# EAGLE design SKAARDUINO_v4 (EAGLE 7.5.0)

## Sheet 1 of 3
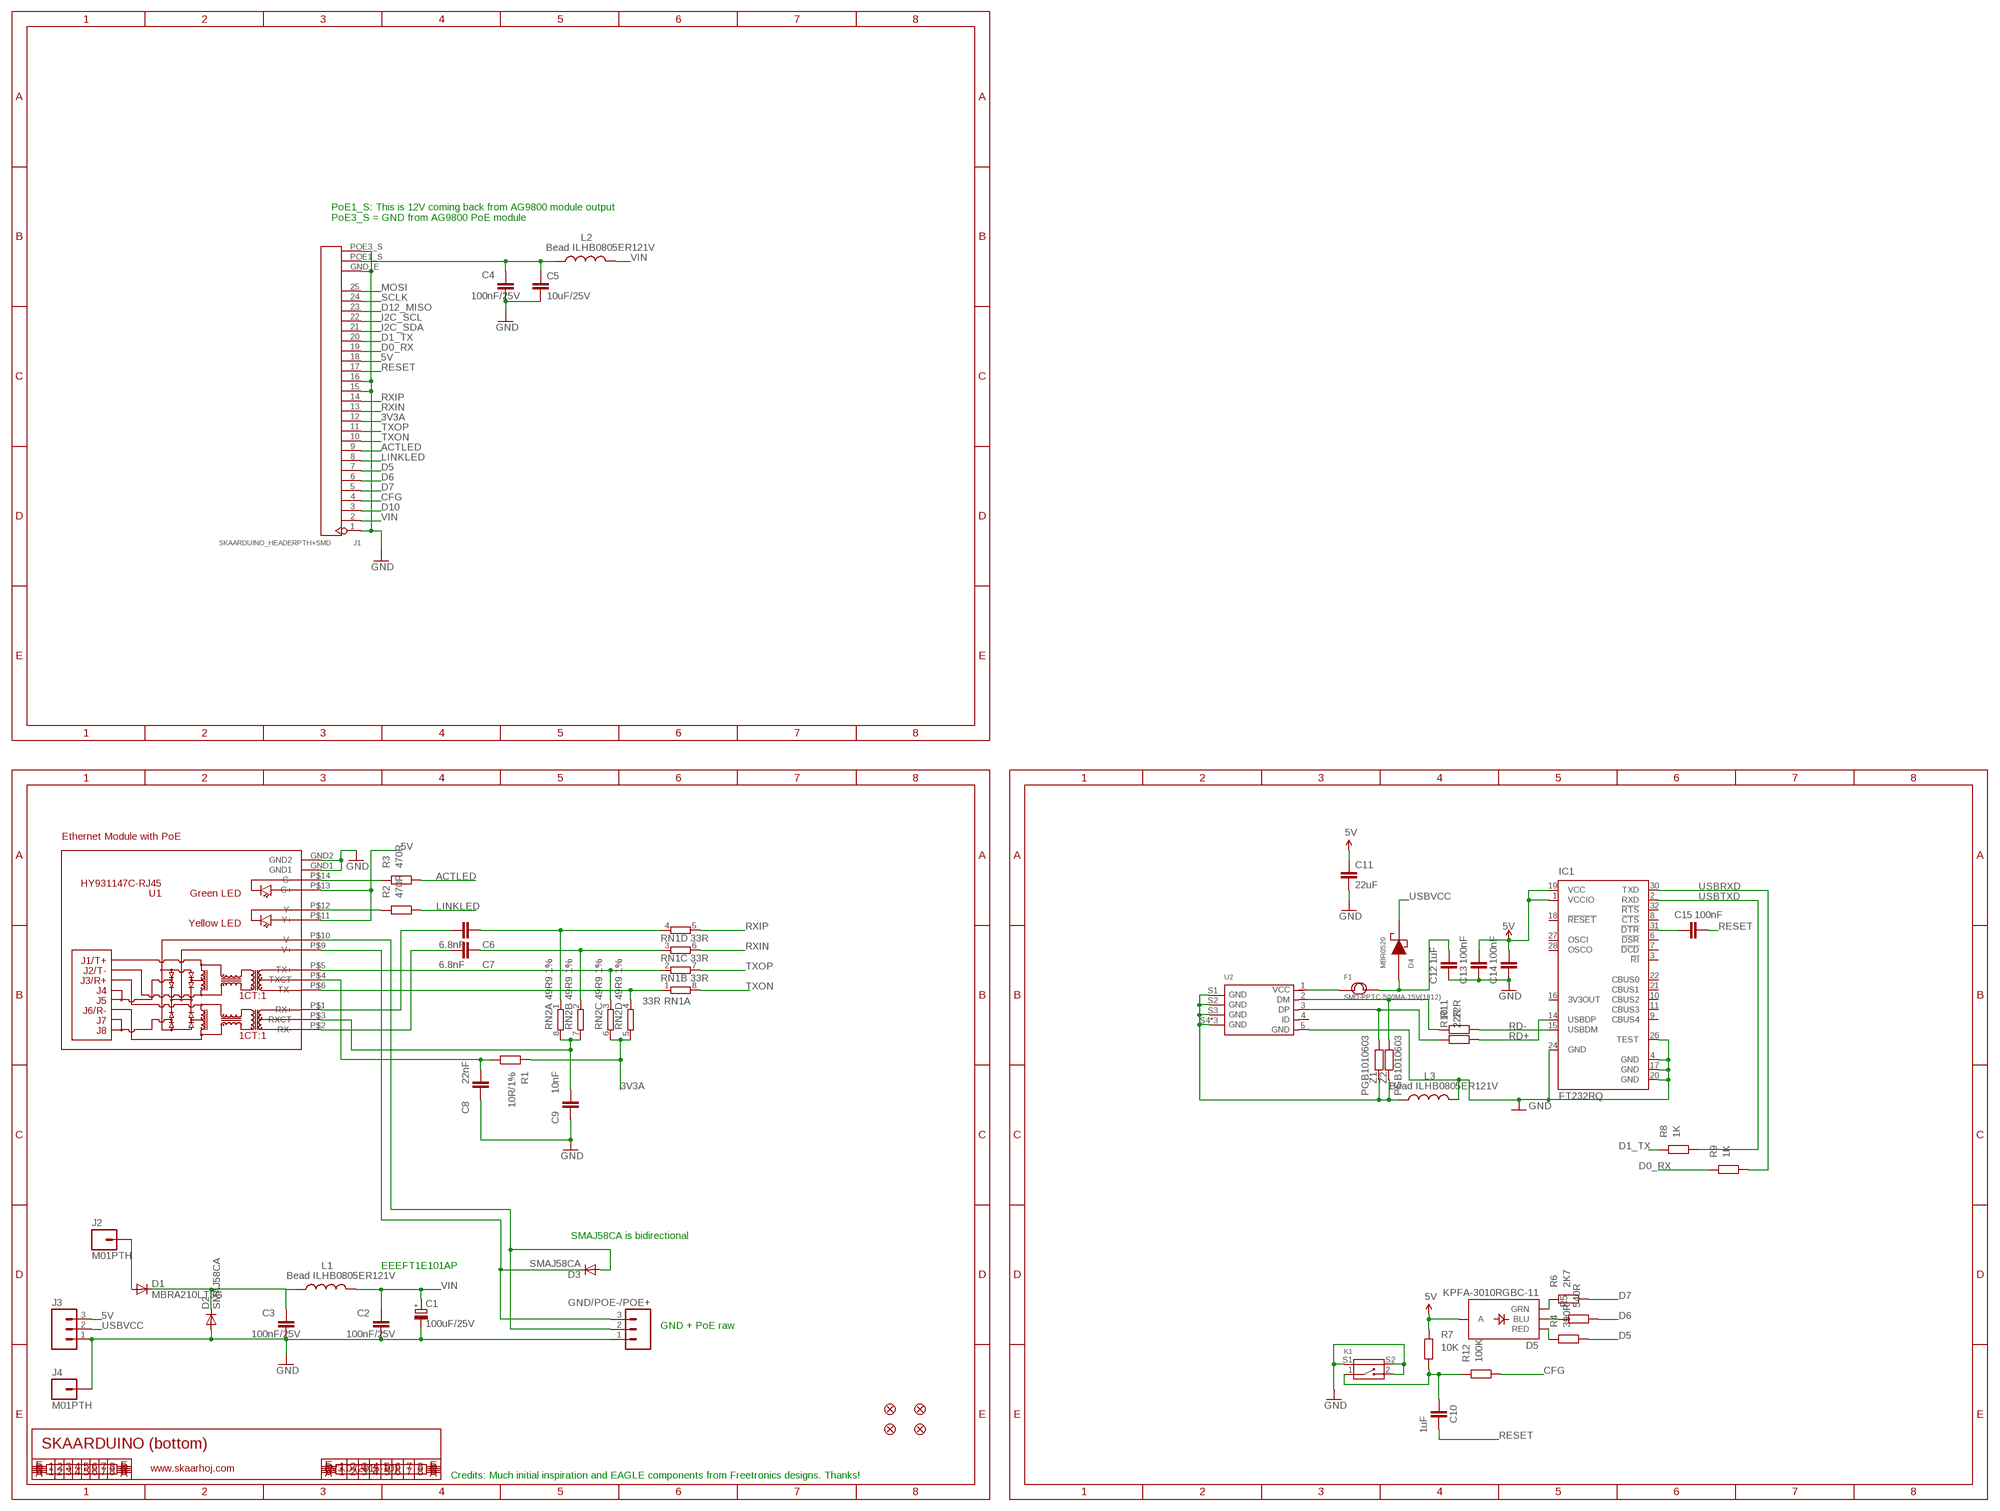
[diagram p0: schematic, sheet 1]

### Parts
C1  100uF/25V  CPOL-EUD  [PANASONIC_D]
C2  100nF/25V  CAP0402  [C0402]
C3  100nF/25V  CAP0402  [C0402]
C4  100nF/25V  CAP0402  [C0402]
C5  10uF/25V  CAP0805  [0805]
C6  6.8nF  C-EU0402C  [0402C]
C7  6.8nF  C-EU0402C  [0402C]
C8  22nF  C-EU0402C  [0402C]
C9  10nF  C-EU0402C  [0402C]
C10  1uF  C-EU0402C  [0402C]
C11  22uF  CAP0805  [0805]
C12  1uF  C-EU0402C  [0402C]
C13  100nF  C-EU0402C  [0402C]
C14  100nF  C-EU0402C  [0402C]
C15  100nF  C-EU0402C  [0402C]
D1  MBRA210LT3G  DIODESMA  [SMA-DIODE]
D2  SMAJ58CA  DIODESMA  [SMA-DIODE]
D3  SMAJ58CA  DIODESMA  [SMA-DIODE]
D4  MBR0520  [SOD-123]
D5  KPFA-3010RGBC-11  LED-TRICOLOR  [LED-TRICOLOR-SMD]
F1  SMD-PPTC-500MA-15V(1812)  [F1812]
FID1  FIDUCIAL1X2.5  [FIDUCIAL-1X2.5]
FID2  FIDUCIAL1X2.5  [FIDUCIAL-1X2.5]
FID3  FIDUCIAL1X2.5  [FIDUCIAL-1X2.5]
FID4  FIDUCIAL1X2.5  [FIDUCIAL-1X2.5]
GND/POE-/POE+  M03LOCK  [1X03_LOCK]
IC1  FT232RQ  [QFN32]
J1  SKAARDUINO_HEADERPTH+SMD  [SKAARDUINO_PTH_SMD_HEADER]
J2  M01PTH  [1X01]
J3  M03LOCK  [1X03_LOCK]
J4  M01PTH  [1X01]
K1  SMD-BUTTON-2+2P  [SW4-SMD-7.0X3.5X3.5MM-90D]
L1  Bead ILHB0805ER121V  L-USL2012C  [L2012C]
L2  Bead ILHB0805ER121V  L-USL2012C  [L2012C]
L3  Bead ILHB0805ER121V  L-USL2012C  [L2012C]
R1  10R/1%  RESISTOR0402  [0402]
R2  470R  RESISTOR0402  [0402]
R3  470R  RESISTOR0402  [0402]
R4  390R  RESISTOR0402  [0402]
R5  540R  RESISTOR0402  [0402]
R6  2K7  RESISTOR0402  [0402]
R7  10K  RESISTOR0402  [0402]
R8  1K  RESISTOR0402  [0402]
R9  1K  RESISTOR0402  [0402]
R10  22R  RESISTOR0402  [0402]
R11  22R  RESISTOR0402  [0402]
R12  100K  RESISTOR0402  [0402]
RN1  33R  4R-NCAY16  [CAY16]
RN2  49R9 1%  4R-NCAY16  [CAY16]
U1  HY931147C-RJ45  [HY931147C]
U2  MICRO-USB-SMD-B-WITHOUT-POST-W/P(ST-USB-001G)  [MICRO-USB5+4P-SMD-0.65-B]
Z1  PGB1010603  RESISTOR0402  [C0402]
Z2  PGB1010603  RESISTOR0402  [C0402]

### Nets
3V3A: J1.12 R1.2 RN2.5 RN2.6 ; also sheet 2
5V [power]: C11.1 C13.2 C14.2 D5.A IC1.1(VCCIO) IC1.19(VCC) J1.18 J3.3 R7.2 U1.P$11(Y+) U1.P$13(G+) ; also sheet 2
ACTLED: J1.9 R3.1 ; also sheet 2
CFG: J1.4 R12.1 ; also sheet 2
CFGSW: C10.2 K1.1 R7.1 R12.2
D0_RX: J1.19 R9.2 ; also sheet 2
D1_TX: J1.20 R8.2 ; also sheet 2
D5: J1.7 R4.1 ; also sheet 2
D6: J1.6 R5.1 ; also sheet 2
D7: J1.5 R6.1 ; also sheet 2
D10: J1.3 ; also sheet 2
D12_MISO: J1.23 ; also sheet 2
GND [power]: C1.- C2.2 C3.2 C4.2 C5.2 C8.1 C9.1 C11.2 C12.1 C13.1 C14.1 D2.A GND/POE-/POE+.1 IC1.4(GND) IC1.17(GND) IC1.20(GND) IC1.24(GND) IC1.26(TEST) J1.1 J1.15 J1.16 J1.GND_E J1.POE3_S J3.1 J4.1 K1.2 K1.S1 K1.S2 L3.2 U1.GND1 U1.GND2 U2.5(GND) ; also sheet 2
I2C_SCL: J1.22 ; also sheet 2
I2C_SDA: J1.21 ; also sheet 2
LINKLED: J1.8 R2.1 ; also sheet 2
MOSI: J1.25 ; also sheet 2
N$1: C8.2 R1.1 U1.P$4(TXCT)
N$2 [VIN]: C4.1 C5.1 J1.POE1_S L2.1
N$3 [VIN]: D3.C GND/POE-/POE+.3 U1.P$9(V+)
N$4 [VIN]: C3.1 D1.C D2.C L1.1
N$5 [VIN]: D3.A GND/POE-/POE+.2 U1.P$10(V-)
N$6 [VIN]: C12.2 D4.2(AN) F1.2
N$7 [VIN]: F1.1 U2.1(VCC)
N$9: C7.2 U1.P$2(RX-)
N$10: D5.G(GRN) R6.2
N$11: C6.2 U1.P$1(RX+)
N$13 [VIN]: D1.A J2.1
N$14: D5.B(BLU) R5.2
N$15: D5.R(RED) R4.2
N$16: R10.2 U2.3(DP) Z1.1
N$17: R11.2 U2.2(DM) Z2.1
N$18: C15.1 IC1.31(!DTR)
N$21: L3.1 U2.S1(GND) U2.S2(GND) U2.S3(GND) U2.S4(GND) U2.S5(GND) U2.S6(GND) Z1.2 Z2.2
N$67: R3.2 U1.P$14(G-)
N$321: C9.2 RN2.7 RN2.8 U1.P$3(RXCT)
N$332: R2.2 U1.P$12(Y-)
RD+: IC1.14(USBDP) R10.1
RD-: IC1.15(USBDM) R11.1
RESET: C10.1 C15.2 J1.17 ; also sheet 2
RXIN: J1.13 RN1.6 ; also sheet 2
RXIN_E: C7.1 RN1.3 RN2.2
RXIP: J1.14 RN1.5 ; also sheet 2
RXIP_E: C6.1 RN1.4 RN2.1
SCLK: J1.24 ; also sheet 2
TXON: J1.10 RN1.8 ; also sheet 2
TXON_E: RN1.1 RN2.4 U1.P$6(TX-)
TXOP: J1.11 RN1.7 ; also sheet 2
TXOP_E: RN1.2 RN2.3 U1.P$5(TX+)
USBRXD: IC1.30(TXD) R9.1
USBTXD: IC1.2(RXD) R8.1
USBVCC [VIN]: D4.1(CA) J3.2
VIN [VIN]: C1.+ C2.1 J1.2 L1.2 L2.2 ; also sheet 2
Unconnected: IC1.3(!RI) IC1.6(!DSR) IC1.7(!DCD) IC1.8(!CTS) IC1.9(CBUS4) IC1.10(CBUS2) IC1.11(CBUS3) IC1.16(3V3OUT) IC1.18(!RESET) IC1.21(CBUS1) IC1.22(CBUS0) IC1.27(OSCI) IC1.28(OSCO) IC1.32(!RTS) U2.4(ID)

### Notes on the sheet
- PoE1_S: This is 12V coming back from AG9800 module output
  PoE3_S = GND from AG9800 PoE module
- Ethernet Module with PoE
- SMAJ58CA is bidirectional
- EEEFT1E101AP
- GND + PoE raw
- SKAARDUINO (bottom)
- www.skaarhoj.com | V3.0 (2015-10)
- Credits: Much initial inspiration and EAGLE components from Freetronics designs. Thanks!

## Sheet 2 of 3
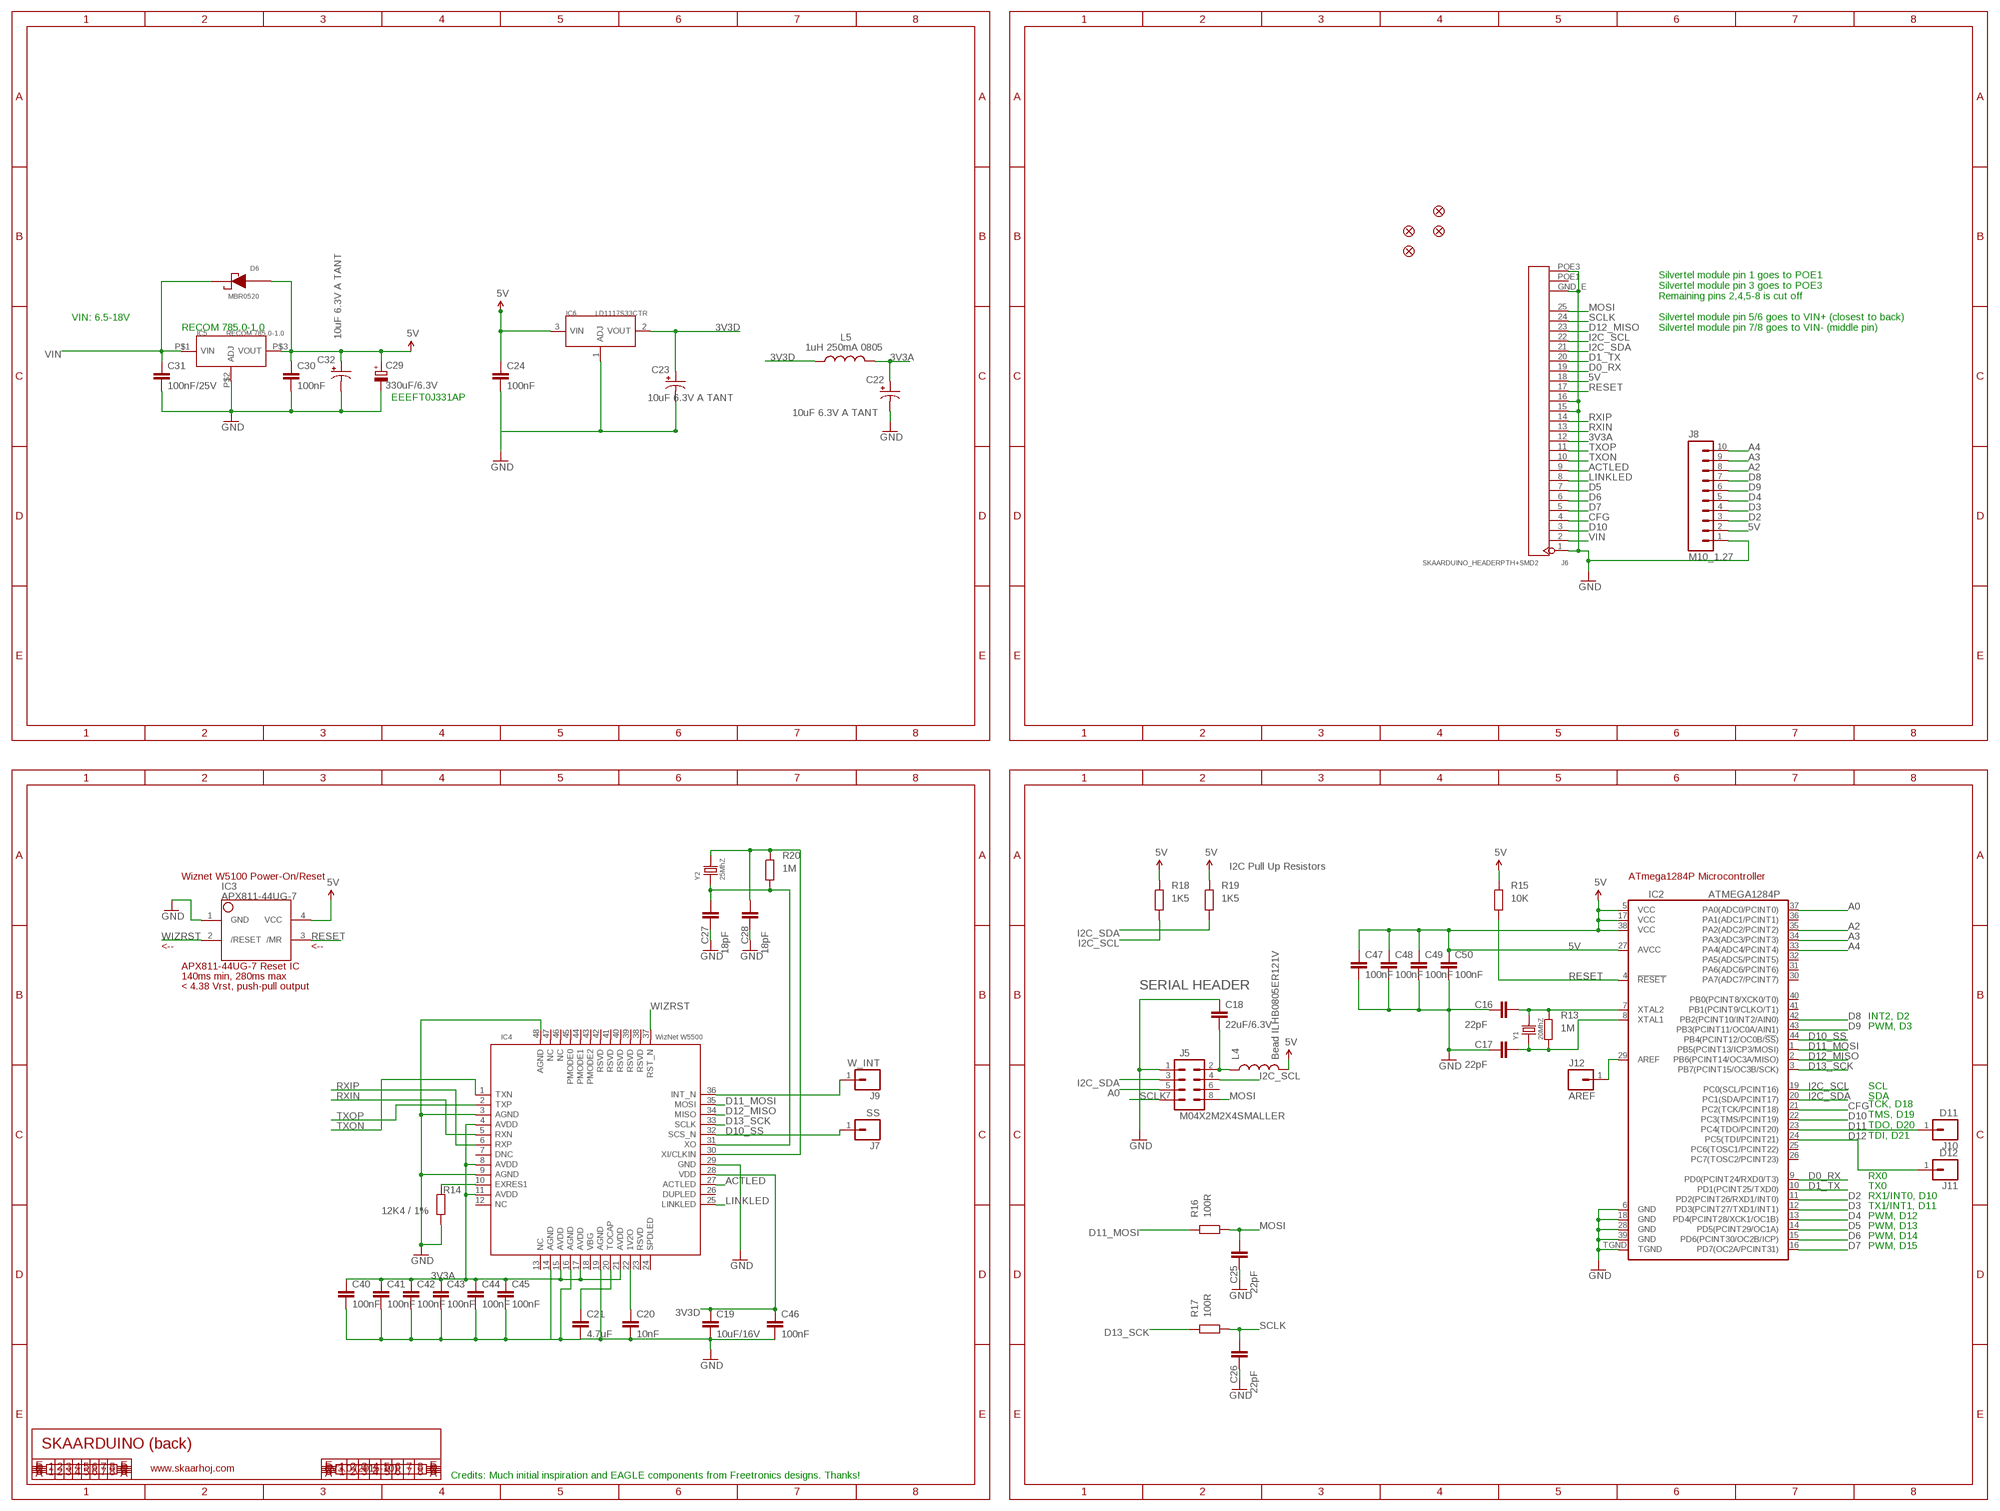
[diagram p1: schematic, sheet 2]

### Parts
C16  22pF  C-EU0402C  [0402C]
C17  22pF  C-EU0402C  [0402C]
C18  22uF/6.3V  CAP0805  [0805]
C19  10uF/16V  CAP0805  [0805]
C20  10nF  C-EU0402C  [0402C]
C21  4.7uF  CAP0805  [0805]
C22  10uF 6.3V A TANT  CAP_POL1206  [EIA3216]
C23  10uF 6.3V A TANT  CAP_POL1206  [EIA3216]
C24  100nF  C-EU0402C  [0402C]
C25  22pF  C-EU0402C  [0402C]
C26  22pF  C-EU0402C  [0402C]
C27  18pF  C-EU0402C  [0402C]
C28  18pF  C-EU0402C  [0402C]
C29  330uF/6.3V  CPOL-EUD  [PANASONIC_D]
C30  100nF  C-EU0402C  [0402C]
C31  100nF/25V  C-EU0402C  [0402C]
C32  10uF 6.3V A TANT  CAP_POL1206  [EIA3216]
C40  100nF  C-EU0402C  [0402C]
C41  100nF  C-EU0402C  [0402C]
C42  100nF  C-EU0402C  [0402C]
C43  100nF  C-EU0402C  [0402C]
C44  100nF  C-EU0402C  [0402C]
C45  100nF  C-EU0402C  [0402C]
C46  100nF  C-EU0402C  [0402C]
C47  100nF  C-EU0402C  [0402C]
C48  100nF  C-EU0402C  [0402C]
C49  100nF  C-EU0402C  [0402C]
C50  100nF  C-EU0402C  [0402C]
D6  MBR0520  [SOD-123]
FID5  FIDUCIAL1X2.5  [FIDUCIAL-1X2.5]
FID6  FIDUCIAL1X2.5  [FIDUCIAL-1X2.5]
FID7  FIDUCIAL1X2.5  [FIDUCIAL-1X2.5]
FID8  FIDUCIAL1X2.5  [FIDUCIAL-1X2.5]
IC2  ATMEGA1284P  [QFN-44M1]
IC3  APX811-44UG-7  APX81X-RESET-IC  [SOT143-R]
IC4  WizNet W5500  DRIVER-W5500  [LQFP-48]
IC5  RECOM 785.0-1.0  PMIC-LM317EMP  [RECOM_785.0-1.0]
IC6  LD1117S33CTR  PMIC-LM317EMPUPRIGHT  [SOT-223-UPRIGHT]
J5  M04X2M2X4SMALLER  [M2X4SMALLER]
J6  SKAARDUINO_HEADERPTH+SMD2  [SKAARDUINO_PTH_SMD2_HEADER]
J7  SS  M1X1TEST  [M1X1]
J8  M10_1.27  [M10X1]
J9  W_INT  M1X1TEST  [M1X1]
J10  D11  M1X1TEST  [M1X1]
J11  D12  M1X1TEST  [M1X1]
J12  AREF  M1X1TEST  [M1X1]
L4  Bead ILHB0805ER121V  INDUCTOR0805  [0805]
L5  1uH 250mA 0805  L-USL2012C  [L2012C]
R13  1M  RESISTOR0402  [0402]
R14  12K4 / 1%  RESISTOR0402  [0402]
R15  10K  RESISTOR0402  [0402]
R16  100R  RESISTOR0402  [0402]
R17  100R  RESISTOR0402  [0402]
R18  1K5  RESISTOR0402  [0402]
R19  1K5  RESISTOR0402  [0402]
R20  1M  RESISTOR0402  [0402]
Y1  20MhZ  SMD-CRYSTAL-16MHZ-8PF-20PPM-40R(2P-5.0X3.2MM)  [X2-SMD-5.0X3.2X1.3MM]
Y2  25MhZ  SMD-CRYSTAL-16MHZ-8PF-20PPM-40R(2P-5.0X3.2MM)  [X2-SMD-5.0X3.2X1.3MM]

### Nets
3V3A: C22.A(+) C40.1 C41.1 C42.1 C43.1 C44.1 C45.1 IC4.4(AVDD) IC4.8(AVDD) IC4.11(AVDD) IC4.15(AVDD) IC4.17(AVDD) IC4.21(AVDD) J6.12 L5.2 ; also sheet 1
3V3D [power]: C19.1 C23.A(+) C46.1 IC4.28(VDD) IC6.2(VOUT) L5.1
5V [power]: C24.1 C29.+ C30.1 C32.A(+) C47.1 C48.1 C49.1 C50.1 D6.2(AN) IC2.5(VCC) IC2.17(VCC) IC2.27(AVCC) IC2.38(VCC) IC3.4(VCC) IC5.P$3(VOUT) IC6.3(VIN) J6.18 J8.2 L4.2 R15.2 R18.2 R19.2 ; also sheet 1
A0: IC2.37(PA0(ADC0/PCINT0)) J5.5
A2: IC2.35(PA2(ADC2/PCINT2)) J8.8
A3: IC2.34(PA3(ADC3/PCINT3)) J8.9
A4: IC2.33(PA4(ADC4/PCINT4)) J8.10
ACTLED: IC4.27(ACTLED) J6.9 ; also sheet 1
CFG: IC2.21(PC2(TCK/PCINT18)) J6.4 ; also sheet 1
D0_RX: IC2.9(PD0(PCINT24/RXD0/T3)) J6.19 ; also sheet 1
D1_TX: IC2.10(PD1(PCINT25/TXD0)) J6.20 ; also sheet 1
D2: IC2.11(PD2(PCINT26/RXD1/INT0)) J8.3
D3: IC2.12(PD3(PCINT27/TXD1/INT1)) J8.4
D4: IC2.13(PD4(PCINT28/XCK1/OC1B)) J8.5
D5: IC2.14(PD5(PCINT29/OC1A)) J6.7 ; also sheet 1
D6: IC2.15(PD6(PCINT30/OC2B/ICP)) J6.6 ; also sheet 1
D7: IC2.16(PD7(OC2A/PCINT31)) J6.5 ; also sheet 1
D8: IC2.42(PB2(PCINT10/INT2/AIN0)) J8.7
D9: IC2.43(PB3(PCINT11/OC0A/AIN1)) J8.6
D10: IC2.22(PC3(TMS/PCINT19)) J6.3 ; also sheet 1
D10_SS: IC2.44(PB4(PCINT12/OC0B/!SS!)) IC4.32(SCS_N) J7.1
D11: IC2.23(PC4(TDO/PCINT20)) J10.1
D11_MOSI: IC2.1(PB5(PCINT13/ICP3/MOSI)) IC4.35(MOSI) R16.2
D12: IC2.24(PC5(TDI/PCINT21)) J11.1
D12_MISO: IC2.2(PB6(PCINT14/OC3A/MISO)) IC4.34(MISO) J6.23 ; also sheet 1
D13_SCK: IC2.3(PB7(PCINT15/OC3B/SCK)) IC4.33(SCLK) R17.2
GND [power]: C16.1 C17.1 C18.1 C19.2 C20.2 C21.2 C22.C(-) C23.C(-) C24.2 C25.1 C26.1 C27.1 C28.1 C29.- C30.2 C31.2 C32.C(-) C40.2 C41.2 C42.2 C43.2 C44.2 C45.2 C46.2 C47.2 C48.2 C49.2 C50.2 IC2.6(GND) IC2.18(GND) IC2.28(GND) IC2.39(GND) IC2.TGND IC3.1(GND) IC4.3(AGND) IC4.9(AGND) IC4.14(AGND) IC4.16(AGND) IC4.19(AGND) IC4.29(GND) IC4.48(AGND) IC5.P$2(ADJ) IC6.1(ADJ) J5.1 J6.1 J6.15 J6.16 J6.GND_E J6.POE3 J8.1 R14.1 ; also sheet 1
I2C_SCL: IC2.19(PC0(SCL/PCINT16)) J5.4 J6.22 R18.1 ; also sheet 1
I2C_SDA: IC2.20(PC1(SDA/PCINT17)) J5.3 J6.21 R19.1 ; also sheet 1
LINKLED: IC4.25(LINKLED) J6.8 ; also sheet 1
MOSI: C25.2 J5.8 J6.25 R16.1 ; also sheet 1
N$8: C16.2 IC2.7(XTAL2) R13.2 Y1.2
N$12: C17.2 IC2.8(XTAL1) R13.1 Y1.1
N$19 [power]: C18.2 J5.2 L4.1
N$20: C21.1 IC4.20(TOCAP)
N$22: C20.1 IC4.22(1V2O)
N$23: IC4.10(EXRES1) R14.2
N$24: IC4.36(INT_N) J9.1
N$25: IC2.29(AREF) J12.1
RESET: IC2.4(!RESET) IC3.3(/MR) J6.17 R15.1 ; also sheet 1
RXIN: IC4.5(RXN) J6.13 ; also sheet 1
RXIP: IC4.6(RXP) J6.14 ; also sheet 1
SCLK: C26.2 J5.7 J6.24 R17.1 ; also sheet 1
TXON: IC4.1(TXN) J6.10 ; also sheet 1
TXOP: IC4.2(TXP) J6.11 ; also sheet 1
VIN [VIN]: C31.1 D6.1(CA) IC5.P$1(VIN) J6.2 ; also sheet 1
WIZRST: IC3.2(/RESET) IC4.37(RST_N)
XTLN: C28.2 IC4.30(XI/CLKIN) R20.2 Y2.2
XTLP: C27.2 IC4.31(XO) R20.1 Y2.1
Unconnected: IC2.25(PC6(TOSC1/PCINT22)) IC2.26(PC7(TOSC2/PCINT23)) IC2.30(PA7(ADC7/PCINT7)) IC2.31(PA6(ADC6/PCINT6)) IC2.32(PA5(ADC5/PCINT5)) IC2.36(PA1(ADC1/PCINT1)) IC2.40(PB0(PCINT8/XCK0/T0)) IC2.41(PB1(PCINT9/CLKO/T1)) IC4.7(DNC) IC4.12(NC) IC4.13(NC) IC4.18(VBG) IC4.23(RSVD) IC4.24(SPDLED) IC4.26(DUPLED) IC4.38(RSVD) IC4.39(RSVD) IC4.40(RSVD) IC4.41(RSVD) IC4.42(RSVD) IC4.43(PMODE2) IC4.44(PMODE1) IC4.45(PMODE0) IC4.46(NC) IC4.47(NC) J5.6 J6.POE1

### Notes on the sheet
- VIN: 6.5-18V
- RECOM 785.0-1.0
- Silvertel module pin 1 goes to POE1
  Silvertel module pin 3 goes to POE3
  Remaining pins 2,4,5-8 is cut off
  
  Silvertel module pin 5/6 goes to VIN+ (closest to back)
  Silvertel module pin 7/8 goes to VIN- (middle pin)
- EEEFT0J331AP
- I2C Pull Up Resistors
- Wiznet W5100 Power-On/Reset | ATmega1284P Microcontroller
- <-- | <--
- APX811-44UG-7 Reset IC
- 140ms min, 280ms max
- < 4.38 Vrst, push-pull output | SERIAL HEADER
- INT2, D2
- PWM, D3
- SCL
- SDA
- TCK, D18
  TMS, D19
  TDO, D20
  TDI, D21
- RX0
- TX0
- RX1/INT0, D10
- TX1/INT1, D11
- PWM, D12
- PWM, D13
- PWM, D14
- PWM, D15
- SKAARDUINO (back)
- www.skaarhoj.com | V3.0 (2015-10)
- Credits: Much initial inspiration and EAGLE components from Freetronics designs. Thanks!

## Sheet 3 of 3

## Library data of the parts
C1 C29 = rcl:CPOL-EU: POLARIZED CAPACITOR, European symbol
C2-C4 = freetronics:CAP: Capacitor Standard 0603 ceramic capacitor, and 0.1" leaded capacitor.
C5 C11 C18 C19 C21 = SparkFun:CAP: Capacitor Standard 0603 ceramic capacitor, and 0.1" leaded capacitor.
C6-C10 C12-C17 C20 C24-C28 C30 C31 C40-C50 = freetronics-jon:C-EU: CAPACITOR, European symbol
C22 C23 C32 = freetronics:CAP_POL: Capacitor Polarized These are standard SMD and PTH capacitors. Normally 10uF, 47uF, and 100uF in electrolytic and tantalum varieties. Always verify the external diameter of the through hole cap, it varies with capacity, voltage, and manufacturer. The EIA devices should be standard.
D1-D3 = SparkFun:DIODE: Diode These are standard reverse protection diodes and small signal diodes. SMA package can handle up to about 1A. SOD-323 can handle about 200mA. What the SOD-323 package when ordering, there are some mfgs out there that are 5-pin packages.
D4 D6 = MySMD:MBR0520
D5 = SKAARHOJ:LED-TRICOLOR: Tri-Color LED SMD Proven layout and schematic for triple color LED in SMD package - common anode. Spark Fun Electronics SKU : COM-07844
F1 = Seeed-OPL-fuse:SMD-PPTC-500MA-15V(1812): 307010007
FID1-FID8 = freetronics:FIDUCIAL: Fiducial Alignment Points Various fiducial points for machine vision alignment.
GND/POE-/POE+ J3 = SparkFun:M03: Header 3 Standard 3-pin 0.1" header. Use with straight break away headers (SKU : PRT-00116), right angle break away headers (PRT-00553), swiss pins (PRT-00743), machine pins (PRT-00117), and female headers (PRT-00115). Molex polarized connector foot print use with SKU : PRT-08232 with associated crimp pins and housings.
IC1 = ftdichip:FT232R: Source: http://www.ftdichip.com/Documents/DataSheets/DS_FT232R_v104.pdf; MPN: FT232RQ; OC_FARNELL: 1146033; OC_NEWARK: 91K9919
IC2 = freetronics-jon:ATMEGA1284P
IC3 = freetronics-master-v1:APX81X-RESET-IC
IC4 = template:DRIVER-W5500
IC5 IC6 = SKAARHOJ:PMIC-LM317EMP: 3-Terminal Adjustable Regulator
J1 J6 = SKAARHOJ:SKAARDUINO_HEADER
J2 J4 = SparkFun:M01: Header 1 Standard 1-pin 0.1" header. Use with straight break away headers (SKU : PRT-00116), right angle break away headers (PRT-00553), swiss pins (PRT-00743), machine pins (PRT-00117), and female headers (PRT-00115).
J5 = SKAARHOJ:M04X2
J7 J9-J12 = SKAARHOJ:M1X1
J8 = SKAARHOJ:M10_1.27
K1 = Seeed-OPL-Button:SMD-BUTTON-2+2P: 311020023; MPN: TS-1188E
L1-L3 L5 = rcl:L-US: INDUCTOR, American symbol
L4 = SparkFun:INDUCTOR: Inductors Basic Inductor/Choke - 0603 and 1206. Footprints are not proven and vary greatly between part numbers.
R1-R20 = freetronics-jon:RESISTOR: Resistor Basic schematic elements and footprints for 0603, 1206, and PTH 1/10th watt (small) resistors.
RN1 RN2 = freetronics-master-v1:4R-N: Array Chip Resistor Source: RS Component / Phycomp
U1 = freetronics-jon:HY931147C
U2 = Seeed-OPL-Connector:MICRO-USB-SMD-B-WITHOUT-POST-W/P(ST-USB-001G): 320010000; MPN: ST-USB-001G
Y1 Y2 = Seeed-OPL-crystal-osctllator:SMD-CRYSTAL-16MHZ-8PF-20PPM-40R(2P-5.0X3.2MM): 306010054; MPN: X053201602002
Z1 Z2 = freetronics:RESISTOR: Resistor Basic schematic elements and footprints for 0603, 1206, and PTH 1/10th watt (small) resistors.

## Net classes
0 default: width 0.203 mm, clearance 0.127 mm
1 power: width 0.203 mm, clearance 0.127 mm
2 VIN: width 0.406 mm, clearance 0.61 mm

## Board
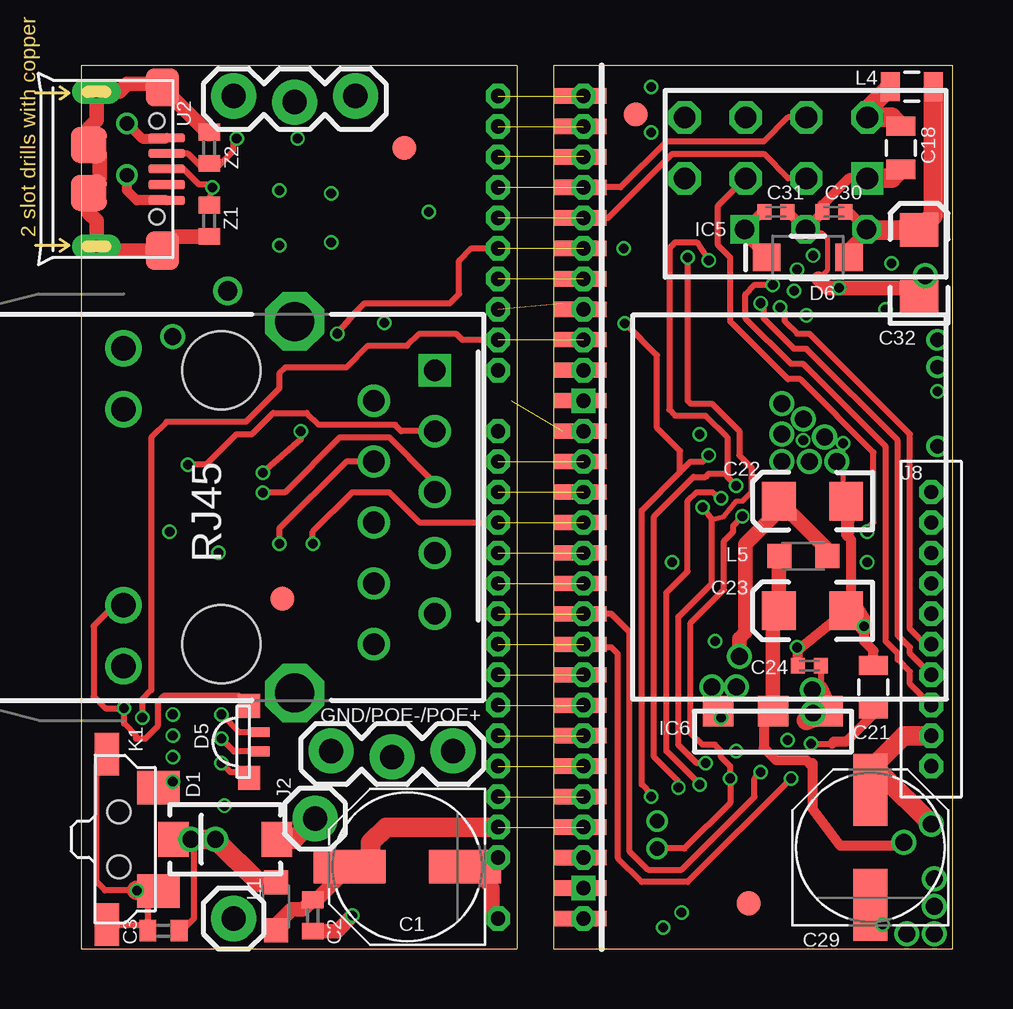
[diagram p2: board, top side]
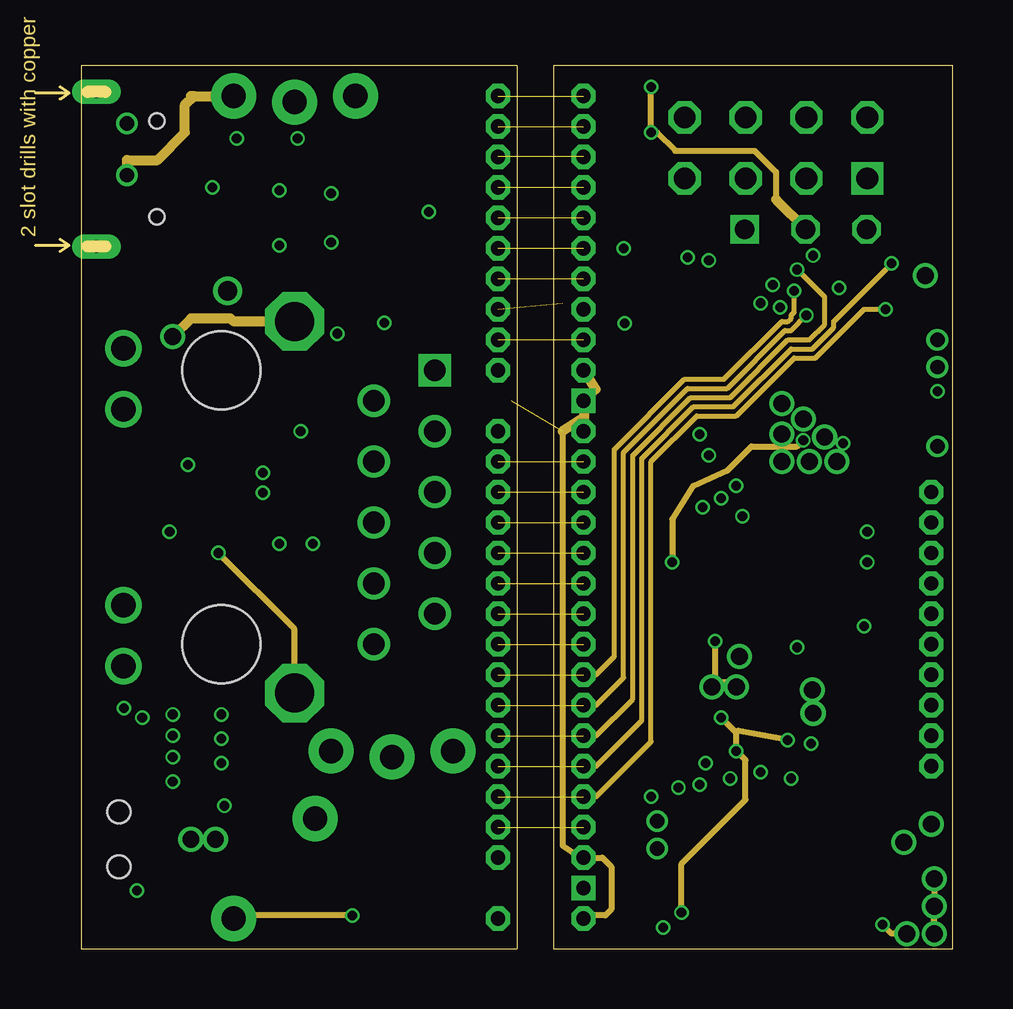
[diagram p3: board, inner layer GND]
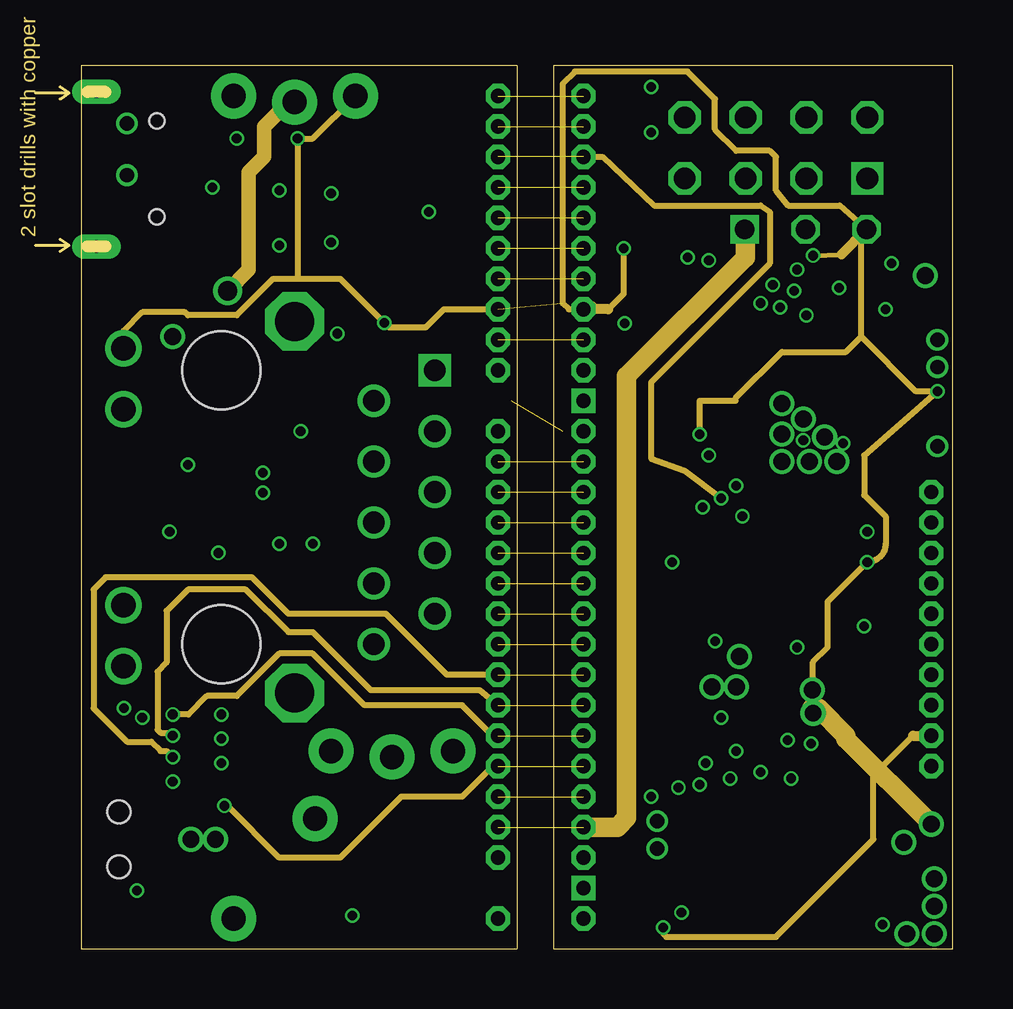
[diagram p4: board, inner layer 5V]
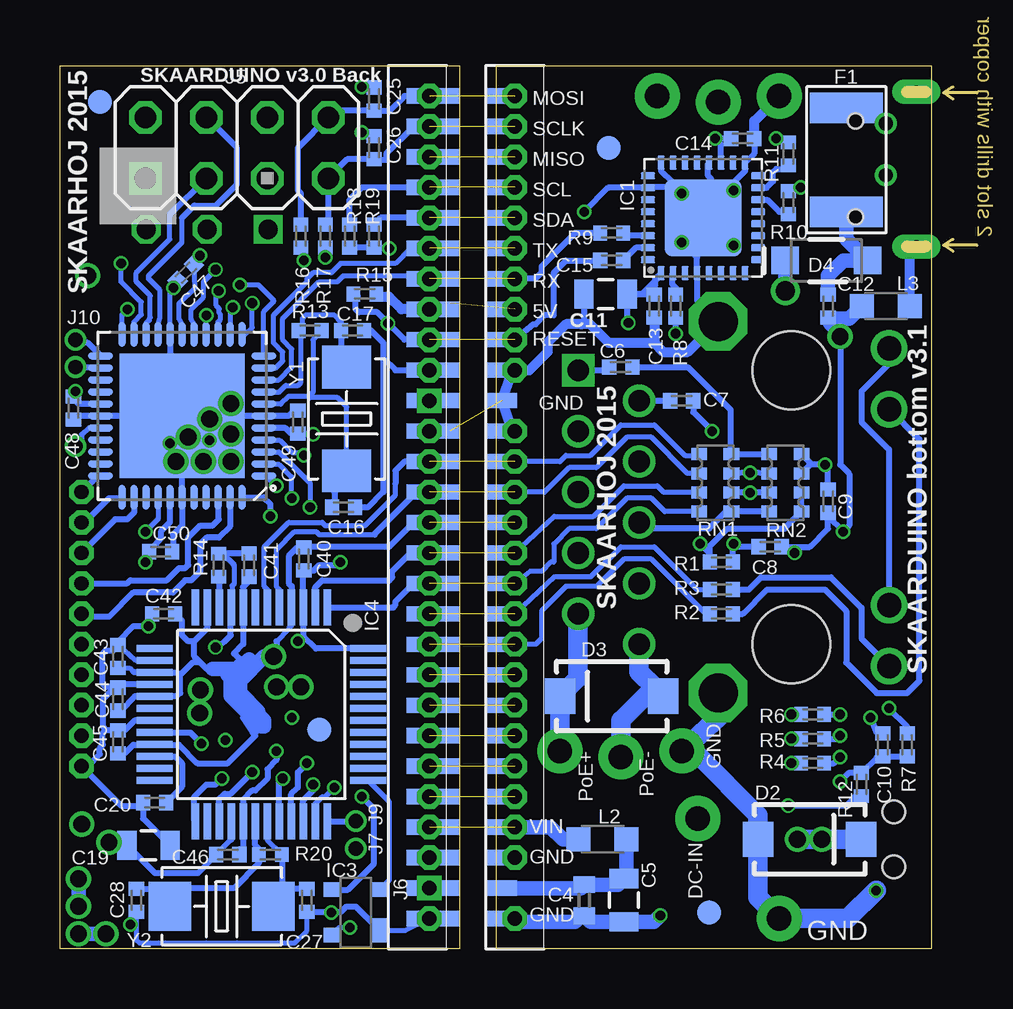
[diagram p5: board, bottom side, seen from below]

Size 36.32 x 36.83 mm. Coordinates in mm from the lower left corner, seen from the top.
Outline: 0,0 18.16,0 18.16,36.83 0,36.83 0,0
Outline: 19.68,0 36.32,0 36.32,36.83 19.68,36.83 19.68,0
Copper layers (1*2*15*16): Top 0.035mm / dielectric 0.2mm / GND 0.0175mm / dielectric 0.3mm / 5V 0.0175mm / dielectric 0.2mm / Bottom 0.035mm
Design rules "SeeedStudio_4layer_DRU_no_angle_20140221 *": minimum track width 8mil, minimum drill 12mil, track to track 8mil, track to pad 8mil, pad to pad 8mil, via to via 8mil, smd to smd 0mil, copper to edge 10mil, drill to drill 8mil, minimum pad ring 6mil, minimum via ring 4mil, stop-mask expansion 4mil, vias tented up to drill 100mil, thermal gap 10mil
tKeepout: area 19.7,0 to 23,36.8
tRestrict: area 7.4,13.6 to 9.4,15.6; area 12.4,32.4 to 14.5,34.4; area 10.3,5.8 to 18.2,15.1; area 22.1,33.8 to 24.1,35.8; area 26.8,0.9 to 28.8,2.9
bRestrict: area 12.4,32.4 to 14.5,34.4; area 8.3,0.5 to 10.3,2.5; area 12.1,1.8 to 18,3.6; area 10.2,6.7 to 16.8,14.9; area 10.3,5.7 to 16.8,6.9; area 24.5,8.1 to 26.5,10.2; area 33.7,34.3 to 35.7,36.3
vRestrict: area 10.2,5.8 to 18,15.1

### Footprints (pad centres in the part's own frame; a part is rotated, then mirrored left to right if it is on the bottom)
PANASONIC_D = smd 3 x 1.4: + 2.4,0; - -2.4,0
C0402 = smd 0.7 x 0.9: 1 -0.65,0; 2 0.65,0
0805 = smd 0.8 x 1.2: 1 -0.9,0; 2 0.9,0
0402C = smd 0.59 x 0.64: 1 -0.48,0; 2 0.48,0
EIA3216 = smd 1.4 x 1.6: A 1.4,0; C -1.4,0
SMA-DIODE = smd 1.27 x 1.47: A -2.15,0; C 2.15,0
SOD-123 = smd 1.143 x 1.143: 1 0,0; 2 3.429,0
LED-TRICOLOR-SMD = smd 1 x 0.9: A -1.5,0; R 1.5,0 | smd 0.4 x 0.8: B 0.4,0.45; G -0.4,0.45
F1812 = smd 1.27 x 3.048: 1 -2.159,0; 2 2.159,0
FIDUCIAL-1X2.5 = smd 1 x 1: 1 0,0
1X03_LOCK = drill 1.016 pad 1.88: 1 0,0.127; 2 2.54,-0.127; 3 5.08,0.127
QFN32 = smd 0.6 x 0.3: 1 -2.3,1.75; 2 -2.3,1.25; 3 -2.3,0.75; 4 -2.3,0.25; 5 -2.3,-0.25; 6 -2.3,-0.75; 7 -2.3,-1.25; 8 -2.3,-1.75; 17 2.3,-1.75; 18 2.3,-1.25; 19 2.3,-0.75; 20 2.3,-0.25; 21 2.3,0.25; 22 2.3,0.75; 23 2.3,1.25; 24 2.3,1.75 | smd 0.3 x 0.6: 9 -1.75,-2.3; 10 -1.25,-2.3; 11 -0.75,-2.3; 12 -0.25,-2.3; 13 0.25,-2.3; 14 0.75,-2.3; 15 1.25,-2.3; 16 1.75,-2.3; 25 1.75,2.3; 26 1.25,2.3; 27 0.75,2.3; 28 0.25,2.3; 29 -0.25,2.3; 30 -0.75,2.3; 31 -1.25,2.3; 32 -1.75,2.3 | smd 3.2 x 3.2: EXP 0,0
QFN-44M1 = smd 0.3 x 1.05: 1 -2.5,-3.4; 2 -2,-3.4; 3 -1.5,-3.4; 4 -1,-3.4; 5 -0.5,-3.4; 6 0,-3.4; 7 0.5,-3.4; 8 1,-3.4; 9 1.5,-3.4; 10 2,-3.4; 11 2.5,-3.4; 23 2.5,3.4; 24 2,3.4; 25 1.5,3.4; 26 1,3.4; 27 0.5,3.4; 28 0,3.4; 29 -0.5,3.4; 30 -1,3.4; 31 -1.5,3.4; 32 -2,3.4; 33 -2.5,3.4 | smd 1.05 x 0.3: 12 3.4,-2.5; 13 3.4,-2; 14 3.4,-1.5; 15 3.4,-1; 16 3.4,-0.5; 17 3.4,0; 18 3.4,0.5; 19 3.4,1; 20 3.4,1.5; 21 3.4,2; 22 3.4,2.5; 34 -3.4,2.5; 35 -3.4,2; 36 -3.4,1.5; 37 -3.4,1; 38 -3.4,0.5; 39 -3.4,0; 40 -3.4,-0.5; 41 -3.4,-1; 42 -3.4,-1.5; 43 -3.4,-2; 44 -3.4,-2.5 | smd 5.2 x 5.2: TGND 0,0
SOT143-R = smd 1 x 0.7: 1 -0.75,-1 | smd 0.6 x 0.7: 2 0.95,-1; 3 0.95,1; 4 -0.95,1
LQFP-48 = smd 1.5 x 0.3: 1 -4.45,2.75; 2 -4.45,2.25; 3 -4.45,1.75; 4 -4.45,1.25; 5 -4.45,0.75; 6 -4.45,0.25; 7 -4.45,-0.25; 8 -4.45,-0.75; 9 -4.45,-1.25; 10 -4.45,-1.75; 11 -4.45,-2.25; 12 -4.45,-2.75; 25 4.45,-2.75; 26 4.45,-2.25; 27 4.45,-1.75; 28 4.45,-1.25; 29 4.45,-0.75; 30 4.45,-0.25; 31 4.45,0.25; 32 4.45,0.75; 33 4.45,1.25; 34 4.45,1.75; 35 4.45,2.25; 36 4.45,2.75 | smd 0.3 x 1.5: 13 -2.75,-4.45; 14 -2.25,-4.45; 15 -1.75,-4.45; 16 -1.25,-4.45; 17 -0.75,-4.45; 18 -0.25,-4.45; 19 0.25,-4.45; 20 0.75,-4.45; 21 1.25,-4.45; 22 1.75,-4.45; 23 2.25,-4.45; 24 2.75,-4.45; 37 2.75,4.45; 38 2.25,4.45; 39 1.75,4.45; 40 1.25,4.45; 41 0.75,4.45; 42 0.25,4.45; 43 -0.25,4.45; 44 -0.75,4.45; 45 -1.25,4.45; 46 -1.75,4.45; 47 -2.25,4.45; 48 -2.75,4.45
RECOM_785.0-1.0 = drill 0.8 square: P$1 -2.54,0 | drill 0.8 octagon: P$2 0,0; P$3 2.54,0
SOT-223-UPRIGHT = smd 1.27 x 1.27: 1 -2.286,0; 2 0,0; 3 2.286,0
SKAARDUINO_PTH_SMD_HEADER = drill 0.6 pad 1.016 octagon: 1 0.79,3.81; 2 0.79,5.08; 3 0.79,6.35; 4 0.79,7.62; 5 0.79,8.89; 6 0.79,10.16; 7 0.79,11.43; 8 0.79,12.7; 9 0.79,13.97; 10 0.79,15.24; 11 0.79,16.51; 12 0.79,17.78; 13 0.79,19.05; 14 0.79,20.32; 15 0.79,21.59; 16 0.79,24.13; 17 0.79,25.4; 18 0.79,26.67; 19 0.79,27.94; 20 0.79,29.21; 21 0.79,30.48; 22 0.79,31.75; 23 0.79,33.02; 24 0.79,34.29; 25 0.79,35.56; GND_E 0.79,1.27 | smd 1.27 x 0.635: GND_E2 0.254,1.27; P$1 0.254,3.81; P$2 0.254,5.08; P$3 0.254,6.35; P$4 0.254,7.62; P$5 0.254,8.89; P$6 0.254,10.16; P$7 0.254,11.43; P$8 0.254,12.7; P$9 0.254,13.97; P$10 0.254,15.24; P$11 0.254,16.51; P$12 0.254,17.78; P$13 0.254,19.05; P$14 0.254,20.32; P$15 0.254,21.59; P$16 0.254,24.13; P$17 0.254,25.4; P$18 0.254,26.67; P$19 0.254,27.94; P$20 0.254,29.21; P$21 0.254,30.48; P$22 0.254,31.75; P$23 0.254,33.02; P$24 0.254,34.29; P$25 0.254,35.56; POE1_S 0.254,2.54; POE3_S 0.254,22.86
1X01 = drill 1.016 pad 1.88: 1 0,0
M2X4SMALLER = drill 0.9 square: 1 -1.27,3.81 | drill 0.9 octagon: 2 1.27,3.81; 3 -1.27,1.27; 4 1.27,1.27; 5 -1.27,-1.27; 6 1.27,-1.27; 7 -1.27,-3.81; 8 1.27,-3.81
SKAARDUINO_PTH_SMD2_HEADER = drill 0.6 pad 1.016 octagon: 1 -1.25,3.81; 2 -1.25,5.08; 3 -1.25,6.35; 4 -1.25,7.62; 5 -1.25,8.89; 6 -1.25,10.16; 7 -1.25,11.43; 8 -1.25,12.7; 9 -1.25,13.97; 10 -1.25,15.24; 11 -1.25,16.51; 12 -1.25,17.78; 13 -1.25,19.05; 14 -1.25,20.32; 15 -1.25,21.59; 16 -1.25,24.13; 17 -1.25,25.4; 18 -1.25,26.67; 19 -1.25,27.94; 20 -1.25,29.21; 21 -1.25,30.48; 22 -1.25,31.75; 23 -1.25,33.02; 24 -1.25,34.29; 25 -1.25,35.56; GND_E -1.25,1.27 | smd 2.2 x 0.635 bottom: P$1 -1.1,5.08; P$2 -1.1,6.35; P$4 -1.1,2.54; P$5 -1.1,1.27; P$6 -1.1,7.62; P$7 -1.1,8.89; P$8 -1.1,10.16; P$9 -1.1,11.43; P$10 -1.1,12.7; P$11 -1.1,13.97; P$12 -1.1,15.24; P$13 -1.1,16.51; P$14 -1.1,17.78; P$15 -1.1,19.05; P$16 -1.1,20.32; P$17 -1.1,21.59; P$18 -1.1,22.86; P$19 -1.1,24.13; P$20 -1.1,25.4; P$21 -1.1,26.67; P$22 -1.1,27.94; P$23 -1.1,29.21; P$24 -1.1,30.48; P$25 -1.1,31.75; P$26 -1.1,33.02; P$27 -1.1,34.29; P$28 -1.1,35.56; P$54 -1.1,3.81 | smd 2.2 x 0.635: P$3 -1.1,3.81; P$29 -1.1,2.54; P$30 -1.1,1.27; P$31 -1.1,5.08; P$32 -1.1,6.35; P$33 -1.1,7.62; P$34 -1.1,8.89; P$35 -1.1,10.16; P$36 -1.1,11.43; P$37 -1.1,12.7; P$38 -1.1,13.97; P$39 -1.1,15.24; P$40 -1.1,16.51; P$41 -1.1,17.78; P$42 -1.1,19.05; P$43 -1.1,20.32; P$44 -1.1,21.59; P$45 -1.1,22.86; P$46 -1.1,24.13; P$47 -1.1,25.4; P$48 -1.1,26.67; P$49 -1.1,27.94; P$50 -1.1,29.21; P$51 -1.1,30.48; P$52 -1.1,31.75; P$53 -1.1,33.02; P$55 -1.1,34.29; P$56 -1.1,35.56 | drill 0.6 pad 1.016 square: POE1 -1.25,2.54; POE3 -1.25,22.86
M1X1 = drill 0.6 pad 0.813: 1 0,0
M10X1 = drill 0.6 pad 1.016 octagon: 1 0,0; 2 0,1.27; 3 0,2.54; 4 0,3.81; 5 0,5.08; 6 0,6.35; 7 0,7.62; 8 0,8.89; 9 0,10.16; 10 0,11.43
SW4-SMD-7.0X3.5X3.5MM-90D = smd 1.397 x 1.778: 1 -2.159,1.651; 2 2.159,1.651 | smd 1.778 x 1.016: S1 -3.556,-0.508; S2 3.556,-0.508 | hole 0.95: -1.15,0; 1.15,0
L2012C = smd 1 x 1: 1 -1,0; 2 1,0
0402 = smd 0.571 x 0.62: 1 -0.48,0; 2 0.48,0
CAY16 = smd 0.5 x 0.65: 1 -1.2,-0.675; 2 -0.4,-0.675; 3 0.4,-0.675; 4 1.2,-0.675; 5 1.2,0.675; 6 0.4,0.675; 7 -0.4,0.675; 8 -1.2,0.675
HY931147C = drill 1.63 octagon: GND1 3.05,7.745; GND2 3.05,-7.745 | drill 0.9 square: P$1 8.89,5.715 | drill 0.9: P$2 6.35,4.445; P$3 8.89,3.175; P$4 6.35,1.905; P$5 8.89,0.635; P$6 6.35,-0.635; P$7 8.89,-1.905; P$8 6.35,-3.175; P$9 8.89,-4.445; P$10 6.35,-5.715 | drill 1.016: P$11 -4.08,6.625; P$12 -4.08,4.085; P$13 -4.08,-4.085; P$14 -4.08,-6.625 | hole 3.25: 0,5.715; 0,-5.715
MICRO-USB5+4P-SMD-0.65-B = smd 0.381 x 1.524: 1 -1.3,-0.25; 2 -0.65,-0.25; 3 0,-0.25; 4 0.65,-0.25; 5 1.3,-0.25 | smd 1.6 x 1.397: S1 -3.4,-0.427; S6 3.4,-0.427 | drill 0.508 pad 1.016 long: S2 -3.226,-3.175; S5 3.226,-3.175 | smd 1.5 x 1.5: S3 -1,-3.5; S4 1,-3.5 | hole 0.635: -2,-0.65; 2,-0.65
X2-SMD-5.0X3.2X1.3MM = smd 1.778 x 2.032: 1 -2.159,0; 2 2.159,0

### Placement (x,y rotation side)
C1  13.59,3.43 180 top
C2  9.65,1.4 270 top
C3  3.43,0.76 180 top
C4  14.48,2.03 270 bottom
C5  12.83,2.03 270 bottom
C6  12.95,24.26 180 bottom
C7  10.41,22.86 180 bottom
C8  6.73,16.76 180 bottom
C9  4.32,18.67 90 bottom
C10  2.03,8.51 270 bottom
C11  13.59,27.3 180 bottom
C12  4.32,26.8 90 bottom
C13  11.56,26.8 90 bottom
C14  7.87,33.78 180 bottom
C15  13.34,28.7 180 bottom
C16  24.51,18.41 180 bottom
C17  24.13,25.78 180 bottom
C18  34.16,33.4 90 top
C19  32.64,4.32 0 bottom
C20  32.38,6.1 180 bottom
C21  33.02,10.92 90 top
C22  30.48,18.67 180 top
C23  30.48,14.1 180 top
C24  30.35,11.81 180 top
C25  23.24,35.43 270 bottom
C26  23.24,33.4 270 bottom
C27  26.04,2.03 90 bottom
C28  33.15,2.03 90 bottom
C29  32.89,4.24 90 top
C30  31.37,30.73 180 top
C31  28.96,30.73 0 top
C32  34.92,28.57 90 top
C40  26.16,16.26 270 bottom
C41  28.45,16 90 bottom
C42  32,13.97 180 bottom
C43  33.91,12.19 90 bottom
C44  33.91,10.41 90 bottom
C45  33.91,8.64 90 bottom
C46  29.34,3.94 0 bottom
C47  31.09,28.19 225 bottom
C48  35.76,22.56 270 bottom
C49  26.42,21.97 90 bottom
C50  32.13,16.56 0 bottom
D1  6,4.57 180 top
D2  5.08,4.57 0 bottom
D3  13.34,10.54 180 bottom
D4  6.1,28.7 0 bottom
D5  7,8.64 270 top
D6  28.57,28.83 0 top
F1  3.56,32.89 270 bottom
FID1  8.38,14.61 0 top
FID2  9.27,1.52 0 bottom
FID3  13.46,33.4 0 top
FID4  13.46,33.4 0 bottom
FID5  27.81,1.91 0 top
FID6  23.11,34.8 0 top
FID7  25.53,9.14 0 bottom
FID8  34.67,35.31 0 bottom
GND/POE-/POE+  10.41,8.13 0 top
IC1  9.53,30.48 90 bottom
IC2  31.24,22.23 90 bottom
IC3  24,1.52 90 bottom
IC4  27.94,9.78 270 bottom
IC5  30.2,30 0 top
IC6  28.84,9.91 0 top
J1  18.16,0 0 bottom
J2  9.74,5.44 0 top
J3  6.35,35.43 0 top
J4  6.35,1.27 0 top
J5  28.96,33.4 90 bottom
J6  19.68,0 0 bottom
J7  24,4.19 0 bottom
J8  35.43,7.62 0 top
J9  24,5.33 0 top
J10  35.69,25.4 0 top
J11  35.69,24.26 0 top
J12  35.69,20.95 0 top
K1  1.57,4.57 270 top
L1  8.13,1.78 270 top
L2  13.72,4.57 180 bottom
L3  1.91,26.8 180 bottom
L4  34.62,35.94 0 top
L5  30.1,16.38 0 top
R1  8.76,16.13 180 bottom
R2  8.76,13.97 0 bottom
R3  8.76,14.99 0 bottom
R4  4.95,7.75 180 bottom
R5  4.95,8.76 180 bottom
R6  4.95,9.78 180 bottom
R7  1.02,8.51 90 bottom
R8  10.67,26.8 270 bottom
R9  13.34,29.84 180 bottom
R10  5.97,31.11 90 bottom
R11  5.97,33.15 90 bottom
R12  2.92,6.86 90 bottom
R13  25.91,25.78 0 bottom
R14  29.72,16 270 bottom
R15  23.62,27.3 0 bottom
R16  26.29,29.72 270 bottom
R17  25.27,29.72 270 bottom
R18  24.26,29.72 270 bottom
R19  23.24,29.72 270 bottom
R20  27.56,3.94 180 bottom
RN1  9.02,19.43 90 bottom
RN2  6.1,19.43 270 bottom
U1  5.84,18.41 0 top
U2  3.81,32.51 270 top
Y1  24.38,22.1 270 bottom
Y2  29.59,1.78 180 bottom
Z1  5.33,30.35 270 top
Z2  5.33,33.4 90 top

### Tracks (layer width: path | path; a pad name or v marks a point on that pad's centre or on a via)
3V3A  (via drill 0.4, 0.7)  (1 unrouted)
  Top 0.203: 28.83,18.29 28.96,18.16
  Top 0.254: v9.65,16.89 9.65,17.4 11.3,19.05 12.83,19.05 14.1,17.78 J1.12
  Top 0.61: 31.1,16.4 L5.2 31.1,16.65 C22.A 28.96,18.55 28.96,18.16 27.69,16.89 27.69,13.21 27.43,12.95 v27.43,12.19 | 29.21,18.29 28.83,18.29
  Bottom 0.203: C43.1 33.43,11.71 33.27,11.56 | 27.3,12.83 26.8,13.34 26.8,13.36 26.7,13.46 IC4.4
  Bottom 0.254: RN2.6 RN2.5 6.13,17.53 8.51,17.53 9.24,16.79 R1.2 9.24,16.48 v9.65,16.89 | IC4.4 26.67,14.25 26.67,15.11 26.8,15.24 26.8,16.38 26.44,16.74 C40.1 26.13,16.76 22.61,16.76 21.59,17.78 J6.12 | C41.1 28.45,15.34 28.7,15.09 28.7,14.24 IC4.8 28.69,12.71 29.08,12.32 28.83,12.06 28.45,12.06 | 30.23,14.19 IC4.11 30.19,13.37 30.73,12.83 | 30.73,12.83 30.99,12.83 31.24,13.08 31.24,13.69 C42.1 | 33.27,11.56 32.42,11.56 IC4.15 31.47,11.53 31.32,11.43 | C44.1 33.8,9.93 33.2,10.54 32.4,10.54 | 32.4,10.54 IC4.17 | C45.1 33.63,8.16 33.27,8.51 32.41,8.51 | 32.41,8.51 IC4.21 | 32.41,8.51 31.37,8.51 30.61,7.75 29.34,7.75 28.19,8.89 | 28.19,8.89 28.7,9.65 | 27.3,12.83 27.3,12.32 v27.43,12.19 | 32.4,10.54 31.5,10.54 31.32,10.67 31.32,11.43 | 30.48,11.94 30.73,12.19 30.73,12.83 | 29.97,11.68 30.23,11.68 30.48,11.94 | 30.48,11.94 30.81,11.94 31.32,11.43 | 28.19,8.89 28.19,9.02 27.94,9.27
  Bottom 0.61: v27.43,12.19 27.81,12.19 28.83,11.18 28.83,10.67 28.07,9.91 28.07,9.78 27.81,9.53 27.81,9.27 27.94,9.27 29.21,10.54 29.21,11.3 29.34,11.43 29.21,11.43 28.96,11.68 | 29.97,11.68 28.96,11.68 | 28.96,11.68 28.83,11.81 28.7,11.81 28.45,12.06
3V3D  (via drill 0.7)
  Top 0.406: IC6.2 28.45,9.53 28.45,8.38 28.96,7.87 30.23,7.87 30.48,7.62 | 30.48,7.75 30.48,7.62 | 30.48,7.62 30.48,5.84 31.62,4.32 34.16,4.32 v34.29,4.45
  Top 0.61: IC6.2 28.84,13.85 C23.A 29.08,16.36 L5.1
  Top 0.813: 28.84,13.96 C23.A
  Bottom 0.203: 29.19,4.56 C46.1
  Bottom 0.254: IC4.28 29.19,4.56 | C19.1 33.53,4.32 32.38,3.17 30.58,3.17 C46.1
  Bottom 0.406: v34.29,4.45 33.67,4.45 C19.1
5V  (via drill 0.4, 0.7)  (1 unrouted)
  Top 0.254: D5.A 6.59,10.54 3.43,10.54 3.17,10.29 3.17,9.27 2.67,8.76 2.29,8.76 2.29,8.89 1.78,9.4 v1.78,10.03 1.02,10.03 0.51,10.54 0.51,13.46 1.38,14.33 U1.P$13 | IC6.3 30.83,10.7 C24.1 30.83,10.51 v30.5,9.83
  Top 0.406: C30.1 32,30.73 IC5.P$3 32,29.27 D6.2
  Top 0.813: L4.2 35.52,30.57 C32.A 32.76,29.98 IC5.P$3 | C29.+ 32.69,7.29 | 32.69,7.29 34.29,8.89 J8.2 | 30.23,9.52 IC6.3 30.74,10.79 v30.48,10.79 | 32.69,7.29 33.35,7.29 v35.43,5.21
  5V 0.203: v30.5,28.91 31.69,28.96
  5V 0.254: 9.02,27.94 8,27.94 6.48,26.42 4.45,26.42 4.32,26.54 2.54,26.54 1.76,25.77 U1.P$11 | 9.02,27.94 10.79,27.94 v12.64,26.1 12.83,25.91 14.35,25.91 15.11,26.67 J1.18 | 9.02,27.94 v9.02,33.78 9.65,33.78 J3.3 | v22.61,29.21 22.61,27.3 21.97,26.67 | 21.31,26.8 J6.18 20.32,26.67 20.07,26.92 20.07,36.07 20.57,36.58 25.27,36.58 26.42,35.43 26.42,34.16 27.3,33.27 28.7,33.27 28.96,33.02 28.96,31.62 29.46,30.99 31.62,30.99 IC5.P$3 32.51,29.78 32.51,25.53 | v25.78,21.46 25.78,22.86 27.28,22.86 27.28,22.96 29.21,24.89 31.88,24.89 32.51,25.53 | v24.26,0.89 24.26,0.64 24.38,0.51 28.96,0.51 33.02,4.57 33.02,7.24 34.67,8.89 | v30.5,9.83 30.5,11.96 31.11,12.57 31.11,14.48 v32.77,16.13 arc90 33.53,16.89 33.53,18.03 32.64,18.92 32.64,20.57 v35.69,23.24 34.8,23.24 32.51,25.53
  5V 0.406: 21.97,26.67 J6.18 | 20.7,26.8 21.31,26.8 | 34.67,8.89 J8.2 | 31.69,28.96 IC5.P$3
  5V 0.813: v35.43,5.21 31.88,8.76 31.88,8.89 30.74,10.03 30.45,10.03 v30.5,9.83
  Bottom 0.203: 25,0.78 IC3.4 24.69,0.89 v24.26,0.89 | C50.1 32.61,16.28 v32.77,16.13 | IC2.17 31.24,26.04 31.37,26.26 31.37,26.92 30.73,27.54 C47.1 30.75,28.69 v30.5,28.91
  Bottom 0.254: R7.2 1.02,9.27 v1.78,10.03 | C14.2 v9.02,33.78 8.78,33.54 IC1.19 | U1.P$11 1.76,24.4 2.92,23.24 2.92,21.97 1.78,20.83 1.78,14.35 U1.P$13 | C11.1 12.66,27.28 C13.2 11.53,27.94 IC1.1 11.28,28.09 12.06,27.3 C11.1 12.7,26.16 v12.64,26.1 | IC2.5 27.58,21.72 26.92,21.72 26.7,21.49 C49.1 25.81,21.49 v25.78,21.46 | IC2.38 31.75,18.82 31.75,17.78 32.13,17.4 32.13,17.12 C50.1 | C48.1 35.43,22.73 IC2.27 35.55,22.73 35.81,22.99 35.81,23.11 v35.69,23.24 | R18.2 R19.2 22.63,29.24 v22.61,29.21
  Bottom 0.406: J6.18 22.1,26.67 22.61,27.18 23.02,27.18 R15.2
A0  (via drill 0.4)
  Top 0.254: J5.5 26.54,30.99 26.54,29.34 27.05,28.83 27.05,26.16 29.46,23.75 29.97,23.75 33.02,20.7 33.02,17.78 32.77,17.53 v32.77,17.4
  Bottom 0.203: IC2.37 32.24,17.92 v32.77,17.4
A2
  Bottom 0.254: IC2.35 33.24,18.19 33.53,17.91 34.04,17.91 J8.8
A3
  Bottom 0.254: J8.9 35.31,17.78 34.29,18.8 33.77,18.8 IC2.34
A4
  Bottom 0.254: IC2.33 34.76,19.73 J8.10
ACTLED  (via drill 0.4)  (1 unrouted)
  Top 0.254: v28.32,7.37 28.07,7.11 28.07,6.35 25.02,3.3 23.62,3.3 22.86,4.06 22.86,13.21 22.1,13.97 J6.9
  Bottom 0.203: R3.1 9.78,14.99 11.56,16.76 12.95,16.76 14.2,15.52 15.7,15.52 J1.9
  Bottom 0.254: IC4.27 29.69,6.25 29.46,6.48 29.21,6.48 v28.32,7.37
CFG  (via drill 0.4)  (1 unrouted)
  GND 0.203: J6.4 21.46,7.62 23.37,9.53 23.37,20.45 25.53,22.61 27.18,22.61 29.59,25.02 30.48,25.02 31.37,25.91 31.37,26.16 v33.78,28.57
  5V 0.254: J1.4 17.14,7.62 15.88,6.35 13.34,6.35 10.79,3.81 8.26,3.81 6.1,5.97 v5.97,5.97
  Bottom 0.203: IC2.21 33.24,26.14 32.94,26.44 32.94,26.98 33.78,27.81 v33.78,28.57
  Bottom 0.254: R12.1 3.15,6.38 3.56,5.97 v5.97,5.97
CFGSW  (via drill 0.4)
  Top 0.254: v3.81,6.99 3.48,6.99 K1.1
  Bottom 0.254: R7.1 C10.2 2.09,7.97 2.29,7.97 R12.2 3.46,7.34 v3.81,6.99
D0_RX  (1 unrouted)
  Bottom 0.203: IC2.9 27.2,23.73 26.67,24.26 26.67,25.02 27.05,25.4 27.05,26.29 25.53,27.81 24.77,27.81 24.51,28.07 21.56,28.07 J6.19
  Bottom 0.254: R9.2 14.86,29.84 16.26,28.45 16.26,28.19 16.51,27.94 J1.19
D1_TX  (via drill 0.4)  (1 unrouted)
  Top 0.254: v10.67,25.65 11.43,26.54 11.81,26.92 15.37,26.92 15.75,27.3 15.75,28.7 16.26,29.21 J1.20
  Bottom 0.203: IC2.10 27.34,24.23 27.05,24.51 27.05,24.89 27.43,25.27 27.43,26.42 26.04,27.81 26.04,27.94 25.78,28.19 25.02,28.19 24.64,28.57 22.35,28.57 21.72,29.21 J6.20
  Bottom 0.254: R8.2 v10.67,25.65
D2  (via drill 0.4)
  Top 0.254: J8.3 34.54,11.05 34.54,11.56 34.04,12.06 34.04,12.32 33.53,12.83 33.53,20.95 30.1,24.38 29.59,24.38 27.69,26.29 27.69,27.3 28.07,27.69 v28.83,27.69
  Bottom 0.203: IC2.11 27.84,26.57 27.43,26.98 27.43,27.05 28.07,27.69 v28.83,27.69
D3  (via drill 0.4)
  Top 0.254: J8.4 34.54,12.32 34.54,12.57 34.04,13.08 34.04,21.21 30.23,25.02 29.72,25.02 28.45,26.29 28.45,26.8 v28.32,26.92
  Bottom 0.203: IC2.12 28.6,25.62 28.32,25.91 v28.32,26.92
D4  (via drill 0.4)
  Top 0.254: J8.5 35.18,12.7 34.54,13.34 34.54,21.46 30.35,25.65 29.84,25.65 29.34,26.16 29.34,26.54 v29.13,26.75
  Bottom 0.203: 29.21,25.66 29.21,26.67 v29.13,26.75
  Bottom 0.254: 29.21,25.66 IC2.13
D5  (via drill 0.4)  (1 unrouted)
  GND 0.203: J6.7 21.46,11.43 22.23,12.19 22.23,20.83 25.15,23.75 26.8,23.75 29.21,26.16 29.46,26.16 29.59,26.29 29.59,26.42 29.72,26.54 v29.72,27.43
  5V 0.254: v3.81,8 3.56,8.26 3.3,8.26 2.92,8.64 1.91,8.64 0.51,10.03 0.51,14.99 1.02,15.49 7.11,15.49 8.64,13.97 12.7,13.97 15.24,11.43 J1.7
  Bottom 0.203: IC2.14 29.74,26.14 29.64,26.24 29.64,26.47 29.69,26.52 29.69,26.7 29.82,26.82 29.82,27.33 v29.72,27.43
  Bottom 0.254: R4.1 4.06,7.75 v3.81,8
D6  (via drill 0.4)  (1 unrouted)
  GND 0.203: J6.6 21.46,10.16 22.61,11.3 22.61,20.7 25.27,23.37 26.92,23.37 29.34,25.78 29.59,25.78 v30.23,26.42
  5V 0.254: v3.81,8.89 3.68,9.02 3.3,9.02 3.17,9.14 3.17,11.56 3.56,11.94 3.56,14.1 4.45,14.99 6.86,14.99 8.64,13.21 9.65,13.21 12.06,10.79 16.61,10.79 J1.6
  Bottom 0.203: IC2.15 30.24,26.4 v30.23,26.42
  Bottom 0.254: R5.1 3.94,8.76 v3.81,8.89
D7  (via drill 0.4)  (1 unrouted)
  GND 0.203: J6.5 21.46,8.89 22.99,10.41 22.99,20.57 25.4,22.99 27.05,22.99 29.46,25.4 30.35,25.4 30.99,26.04 30.99,27.18 v29.84,28.32
  5V 0.254: v3.81,9.78 R6.1 5.24,10.54 6.48,10.54 8.26,12.32 9.65,12.32 11.81,10.16 15.88,10.16 17.14,8.89 J1.5
  Bottom 0.203: IC2.16 30.74,26.04 30.86,26.24 30.86,26.67 30.35,27.18 30.35,27.81 v29.84,28.32
  Bottom 0.254: R6.1 4.35,9.65 4.35,9.75 4.32,9.78 v3.81,9.78
D8
  Bottom 0.254: J8.7 33.53,15.24 33.4,15.37 31.88,15.37 31.37,15.88 31.11,15.88 30.99,16 30.99,17.14 30.48,17.65 29.97,17.65 29.72,17.91 29.72,18.8 IC2.42
D9
  Bottom 0.254: IC2.43 29.24,17.62 29.72,17.14 30.23,17.14 30.48,16.89 30.48,15.75 30.86,15.37 31.11,15.37 31.62,14.86 33.27,14.86 34.29,13.84 35.31,13.84 J8.6
D10  (via drill 0.4)  (1 unrouted)
  GND 0.203: J6.3 21.46,6.35 23.75,8.64 23.75,20.32 25.65,22.23 27.3,22.23 29.72,24.64 30.61,24.64 32.64,26.67 v33.53,26.67
  Bottom 0.203: IC2.22 33.74,26.46 v33.53,26.67
D10_SS  (via drill 0.4)
  Top 0.254: J7.1 25.15,4.19 27.05,6.1 v27.05,7.11 27.05,7.62 26.67,8 26.67,8.26 26.42,8.51 25.91,8.51 25.4,9.02 25.4,13.59 26.8,14.99 26.8,17.02 27.18,17.4 27.18,17.65 v27.56,18.03
  Bottom 0.254: IC2.44 27.84,18.82 27.56,18.54 v27.56,18.03 | IC4.32 27.19,6.97 v27.05,7.11
D11
  Bottom 0.254: IC2.23 35.18,25.27 35.56,25.27 J10.1
D11_MOSI  (via drill 0.4)
  Top 0.254: 27.05,19.56 v27.3,19.3 26.92,19.68 26.92,19.81 | 26.92,19.81 26.92,21.34 26.04,22.23 24.77,22.23 24.51,22.48 24.51,29.21 24.77,29.46 25.65,29.46 v26.16,28.7 | v24.89,6.73 24.89,6.99 23.88,8 23.88,18.03 25.53,19.68 26.04,19.68 26.16,19.81 26.92,19.81
  Bottom 0.203: IC4.35 25.69,6.06 25.4,6.35 25.27,6.35 v24.89,6.73
  Bottom 0.254: IC2.1 27.73,19.73 v27.3,19.3 | R16.2 v26.16,28.7
D12
  Bottom 0.254: J11.1 34.67,24.26 IC2.24
D12_MISO  (via drill 0.4)  (1 unrouted)
  Top 0.254: v25.78,6.86 24.38,8.26 24.38,14.86 25.27,15.75 25.27,18.67 25.65,19.05 26.29,19.05 v26.67,18.8
  5V 0.254: J6.23 21.72,33.02 23.88,30.99 28.32,30.99 28.7,30.73 28.7,28.57 23.75,23.62 23.75,20.45 25.15,19.94 v26.67,18.8
  Bottom 0.203: v26.67,18.8 26.67,19.68 27.18,20.19 27.81,20.19
  Bottom 0.254: 27.81,20.19 IC2.2 | IC4.34 26.19,6.2 25.78,6.6 v25.78,6.86
D13_SCK  (via drill 0.4)
  Top 0.203: 26.29,17.91 26.8,18.03 27.3,18.67 27.56,18.67 27.94,19.05 27.94,19.56
  Top 0.254: v25.27,28.83 25.27,22.86 25.4,22.73 26.29,22.73 27.43,21.59 27.43,20.57 27.94,20.07 27.94,19.56 | v26.04,7.75 25.65,7.75 24.89,8.51 24.89,13.84 26.29,15.24 26.29,17.91 v25.91,18.41
  Bottom 0.203: IC2.3 27.2,20.73 25.91,19.43 v25.91,18.41
  Bottom 0.254: R17.2 v25.27,28.83 | IC4.33 26.69,6.46 26.42,6.73 26.42,7.37 v26.04,7.75
GND  (via drill 0.4, 0.6, 0.7)  (1 unrouted)
  Top 0.203: v31.75,21.08 31.75,19.18 31.37,18.8 | C29.- 32.69,1.73 v33.4,1.02 | 30.73,27.94 31.11,28.32 31.11,29.59 30.86,29.84 30.35,29.84 IC5.P$2 | v31.6,27.56 31.11,27.56
  Top 0.254: K1.S2 2.52,1.02 C3.2 2.78,1.97 | 2.78,1.97 K1.2 | 2.78,1.97 v2.31,2.44 0.99,2.44 0.64,2.79 0.64,7.7 K1.S1 | IC6.1 26.55,9.77 v26.67,9.65 | v33.4,1.02 32.74,1.78 C29.- | 29.87,12.47 29.87,12.67 v29.84,12.57 | 30.23,29.97 IC5.P$2 | 32.08,17.07 32.13,18.03 31.37,18.8
  Top 0.406: U2.5 2.32,31.21 1.91,31.62 v1.91,32.26 | C31.2 29.46,30.73 IC5.P$2 30.89,30.69 C30.2 30.89,31.02 32,32.13 J5.1 | C24.2 29.87,12.47 C23.C 32.01,13.97 C42.2 32.08,14.37 32.08,17.07 31.88,17.27 C22.C | 34.54,27.56 34.67,27.56 v35.18,28.07 | C21.2 33.02,12.45 32.64,12.83 v32.64,13.46 | IC6.1 26.29,9.91 v26.29,10.92
  Top 0.61: C2.2 10.65,0.75 v11.3,1.4 | J1.1 16.86,3.43 C1.- 16.37,3.31 17.14,2.54 17.14,1.37 J1.GND_E | 30.73,27.94 31.11,27.56 34.54,27.56 C32.C
  Top 0.813: v2.31,2.44 3.2,2.44 K1.2 | J5.1 33.79,32.13 C18.1 | C23.C 32.26,14.1 v32.64,13.46
  GND 0.254: U1.GND2 8.89,13.33 v5.71,16.51 | v11.3,1.4 6.48,1.4 J4.1 | v25.02,1.52 25.02,3.56 27.69,6.22 27.69,7.87 v27.3,8.26 27.3,9.02 | v23.75,35.94 v23.75,34.04 24,34.04 24.77,33.27 28.07,33.27 28.96,32.38 28.96,31.24 | v30.1,21.21 29.84,20.95 27.94,20.95 26.92,19.94 25.53,19.3 24.64,17.91 v24.64,16.13 | 27.3,9.02 v26.67,9.65 | v26.42,12.83 26.42,11.05 v26.29,10.92 | v34.42,0.64 33.78,0.64 v33.4,1.02 | v35.56,2.92 v35.56,1.78 v35.56,0.64 | v29.44,8.71 27.38,9.09 27.3,9.02 | 20.95,22.07 20.8,22.07 | 20.07,21.59 20.07,4.32 20.83,3.81 J6.1 21.72,3.81 22.1,3.43 22.1,1.65 21.84,1.4 21.06,1.4 J6.GND_E
  GND 0.406: v1.91,32.26 1.91,32.89 3.17,32.89 4.32,34.04 4.32,35.18 4.7,35.56 | 4.57,35.56 4.7,35.56 | 4.7,35.56 J3.1 | U1.GND1 6.35,26.16 6.22,26.29 4.57,26.29 v3.81,25.53 | J6.16 21.43,23.34 J6.POE3 20.95,22.07 J6.15 | 28.96,31.24 IC5.P$2 | 20.8,22.07 20.07,21.59 | 26.42,11.05 27.3,11.05 v27.3,10.92
  Bottom 0.203: 29.08,16 29.08,15.21 29.16,15.14 29.16,14.26 | 33.88,12.67 33.17,12.04 32.43,12.04 | IC3.1 21.93,0.77 J6.GND_E | IC2.39 31.24,20.19 31.37,20.32 | v31.5,20.32 31.5,20.83 v31.75,21.08 | v33.4,1.02 33.4,1.3 C28.1 33.15,0.38 33.02,0.25 26.54,0.25 26.04,0.76 C27.1 | 31.75,27.53 31.75,25.63 IC2.18 | 31.75,27.53 C47.2 | 31.75,27.53 31.62,27.53 v31.6,27.56
  Bottom 0.254: 4.42,18.16 C9.1 | v5.71,16.51 5.71,16.74 C8.1 5.08,16.76 4.32,17.53 C9.1 | v14.48,30.73 13.48,31.73 IC1.26 11.8,31.75 10.62,31.75 | C14.1 7.39,33.16 IC1.17 7.78,32.43 8.33,31.88 | 8.33,31.88 9.17,31.88 9.2,31.9 | 9.2,31.9 9.2,32.11 9.32,32.23 9.32,32.73 IC1.20 | IC1.24 11.28,32.43 10.82,31.98 10.82,31.95 10.62,31.75 | 10.62,31.75 10.54,31.75 | 10.54,31.75 9.35,31.75 9.2,31.9 | U1.GND1 9.78,27.04 IC1.4 9.78,28.82 v10.41,29.46 v10.41,31.5 10.41,31.62 10.54,31.75 | 8.33,31.88 8.26,31.8 v8.26,31.62 v8.26,29.34 | C9.1 4.32,18.03 v3.68,17.4 3.43,17.65 3.43,19.81 3.81,20.19 v3.81,25.53 | C11.2 14.49,26.16 14.61,26.05 | C49.2 26.57,22.45 26.8,22.23 IC2.6 IC2.TGND | C17.1 23.37,25.78 22.86,25.27 22.86,24.64 | 22.86,24.64 22.86,19.05 23.5,18.41 C16.1 | 22.86,24.64 22.35,24.13 J6.16 | C41.2 R14.1 29.56,16.48 29.08,16 | 29.16,14.26 IC4.9 29.21,14.21 29.21,13.08 29.46,12.83 v29.84,12.57 | C43.2 33.88,12.67 34.04,12.83 | 32.43,12.04 IC4.14 | 32.76,9.53 32.77,9.53 | C48.2 35.49,22.23 IC2.28 IC2.TGND | 30.23,29.97 IC5.P$2 | IC2.18 31.74,22.73 IC2.TGND | IC2.TGND IC2.39 31.24,17.65 31.62,17.27 31.62,16.66 C50.2 | 26.19,13.05 IC4.3 26.19,15.75 C40.2 25.75,15.78 25.53,16 24.77,16 v24.64,16.13 | 26.19,13.05 v26.42,12.83 | C19.2 32.87,5.44 C20.2 32.99,5.97 33.78,5.97 J8.1 35.18,7.62 34.67,8.13 34.67,8.38 34.54,8.51 34.54,9.02 34.42,9.14 | 28.86,4.16 C46.2 28.69,4.1 IC4.29 28.7,5.34 28.7,6.22 28.32,6.6 28.19,6.6 27.69,7.11 27.69,7.49 27.3,7.87 v27.3,8.26 | IC4.19 32.76,9.53 | 34.06,9.27 C45.2 | IC3.1 24.01,1.78 24.38,1.78 24.61,1.55 C27.1 25.05,1.55 v25.02,1.52 | IC4.48 25.67,12.53 26.19,13.05 | C42.2 32.48,13.87 v32.64,13.46 33.27,13.46 33.91,12.83 C43.2
  Bottom 0.254: C26.1 23.59,33.88 v23.75,34.04 | v23.75,35.94 23.27,35.94 C25.1 | v30.1,21.21 30.23,21.21 IC2.TGND | 32.76,9.53 33.22,9.53 33.63,9.12 C45.2 | 34.42,9.14 34.54,9.27 34.54,10.41 34.06,10.89 C44.2 33.77,11.03 IC4.16 33.93,11.03 34.04,10.92 34.42,10.92 34.54,11.05 34.54,12.32 34.42,12.45 34.13,12.45 C43.2 | 34.42,9.14 33.94,9.14 C45.2
  Bottom 0.406: C12.1 4.32,26.04 v3.81,25.53 | C14.1 7.39,34.52 J3.1 | C13.1 11.56,25.27 | 11.56,25.27 11.18,24.89 10.16,24.89 U1.GND1 | 11.56,25.27 13.46,25.27 14.23,26.05 14.61,26.05 15.23,26.05 16,25.27 16,24.89 16.76,24.13 J1.16 17.53,23.98 J1.POE3_S 17.53,21.75 J1.15
  Bottom 0.61: v11.3,1.4 11.57,1.13 C5.2 14.23,1.13 C4.2 14.62,1.38 14.86,1.14 17.12,1.14 J1.GND_E | L3.2 2.92,26.8 3.43,26.29 4.29,26.29 C12.1 | v29.21,22.73 29.46,22.73 v30.1,22.1 v30.1,21.21 | 30.23,21.21 30.86,21.21 v30.99,21.34 | v31.5,20.32 31.37,20.32 v30.35,20.32 30.35,20.95 v30.1,21.21 | v29.21,21.46 29.84,21.46 v30.1,21.21 | v29.21,20.32 v30.1,21.21 | v34.42,0.64 v35.56,0.64 | v35.56,1.78 v35.56,2.92
  Bottom 0.813: v2.31,2.44 3.48,1.27 J4.1 7.23,2.15 D2.A 7.23,5.58 9.78,8.13 GND/POE-/POE+.1 8.89,9.65 U1.GND2
I2C_SCL  (1 unrouted)
  Top 0.254: J5.4 29.46,34.67 28.45,33.66 24.38,33.66 22.48,31.75 J6.22
  Bottom 0.203: IC2.19 32.24,26.05 32.16,26.31 32.16,27.46 32.64,27.94 32.64,28.07 31.24,29.46 31.24,30.48
  Bottom 0.254: R18.1 24.26,31.24 23.75,31.75 J6.22 | 31.24,30.48 30.73,30.99 29.84,30.99 28.96,31.88 28.96,33.4 J5.4
I2C_SDA  (1 unrouted)
  Top 0.254: J5.3 29.46,32.13 28.45,33.15 24.64,33.15 21.97,30.48 J6.21
  Bottom 0.203: IC2.20 32.74,26.08 32.61,26.21 32.61,26.24 32.56,26.34 32.56,27.23 33.15,27.81 33.15,28.19 31.75,29.59 31.75,30.61
  Bottom 0.254: J6.21 22.96,30.48 R19.1 | 31.75,30.61 J5.3
LINKLED  (via drill 0.4)  (1 unrouted)
  Top 0.254: J6.8 21.59,12.7 21.72,12.57 22.1,12.57 22.35,12.32 22.35,3.81 23.37,2.79 25.27,2.79 v29.59,7.11
  Bottom 0.203: R2.1 9.4,13.97 11.68,16.26 12.83,16.26 13.97,15.11 15.24,15.11 16.26,14.1 16.26,12.95 16.51,12.7 J1.8
  Bottom 0.254: v29.59,7.11 29.84,6.86 30.23,6.86 30.73,6.35 30.73,5.37 IC4.25
MOSI  (1 unrouted)
  Bottom 0.254: J6.25 21.97,35.56 22.61,34.92 23.21,34.92 C25.2 24.86,34.95 J5.8 26.42,33.4 26.42,31.62 26.29,31.5 R16.1
N$1  (via drill 0.4)
  Top 0.254: U1.P$4 11.05,20.32 8.26,17.53 v8.26,16.89
  Bottom 0.254: C8.2 8.13,16.76 v8.26,16.89 8.28,16.86 R1.1
N$2
  Bottom 0.61: J1.POE1_S 14.62,2.54 C4.1 13.08,2.68 C5.1 12.72,3.04 L2.1
N$3
  Bottom 0.813: U1.P$9 14.73,11.29 D3.C GND/POE-/POE+.3
N$4  (via drill 0.7)
  Top 0.254: C3.1 4.08,0.65 4.7,1.27 4.7,4.19 5.08,4.57
  Top 0.813: L1.1 7.38,2.78 v5.59,4.57 5.08,4.57 v4.57,4.57 D1.C
  Bottom 0.813: D2.C v4.57,4.57 v5.59,4.57
N$5
  Bottom 0.813: U1.P$10 12.19,11.55 11.56,10.92 | 11.56,10.92 D3.A | GND/POE-/POE+.2 12.95,9.53 11.56,10.92
N$6
  Bottom 0.61: F1.2 3.56,29.59 D4.2 3.68,28.7 4.32,28.07 C12.2
N$7  (via drill 0.6)
  Top 0.406: v1.91,34.42 2.54,33.78 3.53,33.78 U2.1
  Bottom 0.406: F1.1 2.54,35.05 v1.91,34.42
N$8
  Bottom 0.203: Y1.2 24.38,22.61 24.77,22.99 25.91,22.99 25.96,23.04 | 25.96,23.04 26.8,23.04 27.13,22.71 27.82,22.71 IC2.7 | 25.55,25.63 25.78,25.4 25.78,23.22 25.96,23.04
  Bottom 0.254: R13.2 25.55,25.63 | Y1.2 24.38,19.56 24.89,19.05 24.89,18.51 C16.2
N$9
  Bottom 0.254: U1.P$2 C7.2
N$10  (via drill 0.4)
  Top 0.254: D5.G 6.58,9.04 v5.84,9.78
  Bottom 0.254: R6.2 v5.84,9.78
N$11
  Bottom 0.254: U1.P$1 13.56,24.13 C6.2
N$12
  Bottom 0.203: C17.2 24.61,26.13 24.89,26.42 26.11,26.42 26.24,26.29 26.24,25.93 R13.1 26.29,25.68 26.29,23.62 26.42,23.5 26.92,23.5 27.19,23.23 IC2.8
  Bottom 0.254: C17.2 24.61,24.48 Y1.1
N$13
  Top 0.813: D1.A 8.88,4.57 J2.1
N$14  (via drill 0.4)
  Top 0.254: D5.B 6.37,8.24 v5.84,8.76
  Bottom 0.254: R5.2 v5.84,8.76
N$15  (via drill 0.4)
  Top 0.254: D5.R 6.71,7.14 6.48,7.37 6.22,7.37 v5.84,7.75
  Bottom 0.254: R4.2 v5.84,7.75 5.97,7.62
N$16  (via drill 0.4)
  Top 0.254: Z1.1 v5.46,31.75 5.33,31.88 4.9,31.88 4.27,32.51 U2.3
  Bottom 0.254: v5.46,31.75 5.94,31.62 R10.2
N$17  (via drill 0.4)
  Top 0.254: U2.2 3.58,33.15 4.45,33.15 4.97,32.62 Z2.1 5.7,32.62 6.35,33.27 6.35,33.66 v6.48,33.78
  Bottom 0.254: v6.48,33.78 6.12,33.78 R11.2
N$18
  Bottom 0.254: IC1.31 12.33,29.23 C15.1
N$19
  Top 0.813: C18.2 33.79,34.67 J5.2 32.77,34.99 L4.1
N$20  (via drill 0.4)
  Top 0.254: C21.1 33.02,9.91 | v30.43,8.56 31.29,8.56
  Top 0.406: C21.1 33.02,9.78 31.88,8.64 31.37,8.64 31.29,8.56
  Bottom 0.254: IC4.20 32.38,9.02 30.89,9.02 v30.43,8.56
N$21
  Top 0.61: Z1.2 3.97,29.7 U2.S6 0.81,29.11 U2.S5 0.64,30.35 0.31,30.68 U2.S4 0.31,31.68 0.76,32.13 0.76,33.06 U2.S3 0.31,34.22 0.64,34.54 U2.S2 1.57,35.74 1.91,36.07 3.23,36.07 U2.S1 5.33,33.96 Z2.2
  Bottom 0.406: L3.1 0.91,29.02 U2.S5
N$22
  Bottom 0.254: IC4.22 31.52,8.03 31.24,7.75 31.24,6.76 C20.1
N$23
  Bottom 0.254: R14.2 29.69,15.49 IC4.10
N$24
  Bottom 0.254: IC4.36 J9.1
N$25
  Bottom 0.203: 34.92,21.73 35.12,21.73 35.41,21.44 35.43,21.46 35.43,21.21 J12.1
  Bottom 0.254: IC2.29 34.92,21.73
N$67
  Bottom 0.254: R3.2 7.62,14.99 7.11,15.49 4.19,15.49 2.92,14.22 2.92,12.95 U1.P$14
N$321  (via drill 0.4)
  Top 0.254: U1.P$3 13.34,21.59 13.08,21.84 9.91,21.84 9.4,22.35 8,22.35 7.11,21.46 6.48,21.46 5.21,20.19 v4.45,20.19
  Bottom 0.254: 5.06,20.19 v4.45,20.19 4.32,20.07 C9.2 | 5.06,20.19 RN2.7 | 5.06,20.19 5.06,20.27 RN2.8
N$332
  Bottom 0.254: R2.2 7.87,13.97 6.86,14.99 4.45,14.99 3.56,14.1 3.56,11.94 2.29,10.67 1.02,10.67 0.51,11.18 0.51,21.25 U1.P$12
RD+
  Bottom 0.254: IC1.14 6.85,31.23 6.35,30.73 6.07,30.73 R10.1
RD-
  Bottom 0.254: IC1.15 6.88,31.73 6.6,32 6.6,32.38 6.48,32.51 6.12,32.51 R11.1
RESET  (via drill 0.4)  (1 unrouted)
  Top 0.254: v2.54,9.65 2.54,10.41 2.92,10.79 2.92,21.34 3.56,21.97 6.86,21.97 8.26,23.37 8.26,24 8.51,24.26 11.05,24.26 11.94,25.15 13.59,25.15 14.1,25.65 15.62,25.65 15.88,25.4 J1.17 | v23.75,6.35 23.75,6.48 23.37,6.86 23.37,18.29 24.96,19.88 | 24.96,19.88 25.4,20.32 25.91,20.32 v26.16,20.57 | 24.96,19.88 24.96,20.77 24,21.72 24,24.74 v22.66,26.09
  Bottom 0.203: 27.83,21.21 27.18,21.21 26.67,20.7 26.29,20.7 v26.16,20.57
  Bottom 0.254: C10.1 2.26,8.99 v2.54,9.65 | C15.2 15.24,28.7 15.75,28.19 15.75,26.42 16.13,26.42 16.51,26.04 16.61,26.04 J1.17 | 27.83,21.21 IC2.4 | IC3.3 24.32,2.47 23.24,3.56 23.24,5.84 v23.75,6.35 | 24,27.21 24,26.67 23.88,26.54 23.11,26.54 v22.66,26.09 21.97,25.4 J6.17
  Bottom 0.406: 24,27.21 R15.1
RXIN  (1 unrouted)
  Bottom 0.203: RN1.6 10.18,19.83 11.68,21.34 12.7,21.34 13.97,20.07 15.11,20.07 16.13,19.05 J1.13 | IC4.5 27.19,15 27.3,15.11 27.3,16.64 26.54,17.4 25.65,17.4 25.53,17.27 23.21,17.27
  Bottom 0.254: 23.21,17.27 23.21,17.3 21.46,19.05 J6.13
RXIN_E  (via drill 0.4)
  Top 0.254: v9.14,21.59 9.14,21.23 v7.57,19.86
  Bottom 0.254: RN2.2 v7.57,19.86 RN1.3 | C7.1 9.93,22.38 v9.14,21.59
RXIP  (1 unrouted)
  Bottom 0.203: RN1.5 9.75,20.57 10.29,20.57 11.56,21.84 12.95,21.84 14.22,20.57 15.24,20.57 15.49,20.32 J1.14 | IC4.6 27.69,14.99 27.81,15.11 27.81,16.76 26.8,17.78 25.4,17.78 25.27,17.65 23.62,17.65 22.35,18.92 22.35,19.4
  Bottom 0.254: J6.14 21.97,20.32 22.35,19.94 22.35,19.4
RXIP_E
  Bottom 0.254: C6.1 10.16,24.26 8.38,22.48 8.38,20.67 RN1.4 RN2.1
SCLK  (1 unrouted)
  Bottom 0.254: J6.24 21.59,34.29 22.73,33.15 22.73,32.89 23.21,32.89 C26.2 24.36,32.92 J5.7 25.15,30.32 R17.1
TXON  (1 unrouted)
  Bottom 0.203: RN1.8 11.12,18.23 11.68,18.8 12.7,18.8 13.97,17.53 15.11,17.53 15.75,16.89 15.75,16.13 15.88,16.13 16.26,15.75 16.74,15.75 J1.10
  Bottom 0.254: IC4.1 22.45,14.23 22.45,14.26 22.35,14.35 22.35,14.48 21.59,15.24 J6.10
TXON_E
  Bottom 0.254: RN2.4 RN1.1 8.57,18.23 9.27,17.53 11.94,17.53 U1.P$6
TXOP  (1 unrouted)
  Bottom 0.203: RN1.7 9.71,19.05 11.18,19.05 11.43,19.3 12.83,19.3 14.1,18.03 15.72,18.03 J1.11
  Bottom 0.254: IC4.2 25.69,15.08 25.4,15.37 22.58,15.37 22.58,15.39 22.48,15.49 22.48,15.75 21.72,16.51 J6.11
TXOP_E  (via drill 0.4)
  Top 0.254: v7.57,19.02 v7.58,19.03 8.49,19.03 10.79,21.34 12.83,21.34 14.48,19.68 14.48,19.3 U1.P$5
  Bottom 0.254: RN2.3 7.75,19.03 | 7.75,19.03 RN1.2 | v7.57,19.02 7.57,18.85 7.75,19.03
USBRXD
  Bottom 0.254: IC1.30 12.74,29.73 R9.1
USBTXD
  Bottom 0.254: R8.1 10.54,27.43 10.79,27.69 10.79,28.16 IC1.2
USBVCC  (via drill 0.8)
  5V 0.61: J3.2 8.64,35.31 7.62,34.29 7.62,33.02 6.99,32.38 6.99,28.32 v6.1,27.43
  Bottom 0.61: v6.1,27.43 D4.1
VIN  (1 unrouted)
  Top 0.406: C31.1 28.39,30.73 IC5.P$1 27.66,29.75 D6.1
  Top 0.61: L1.2 8.13,1.02 8.76,1.65 9.26,1.65 C2.1 9.81,2.05 C1.+
  Top 0.813: 11.56,3.44 C1.+ 12.06,3.43 12.06,4.45 12.7,5.08 J1.2
  5V 0.813: J6.2 22.35,5.08 22.73,5.46 22.73,23.88 27.69,28.83 27.69,29.97 IC5.P$1
  Bottom 0.61: L2.2 15.37,4.57 15.88,5.08 J1.2
WIZRST
  Bottom 0.203: IC4.37 22.61,6.14 22.61,2.87 IC3.2
XTLN
  Bottom 0.254: IC4.30 28.19,4.32 28.04,4.16 R20.2 28.04,3.58 29.08,2.54 30.99,2.54 Y2.2 32.48,2.51 C28.2
XTLP
  Bottom 0.203: IC4.31 27.69,4.55 R20.1
  Bottom 0.254: R20.1 27.08,2.77 27.43,2.41 Y2.1 26.7,2.51 C27.2

### Text on the board
_bsilk: SKAARDUINO v3.0 Back | SKAARHOJ 2015 | MOSI | SCLK | MISO | SCL | SDA | TX | RX | SKAARDUINO bottom v3.1 | 5V | RESET | SKAARHOJ 2015 | GND | GND | PoE- | PoE+ | VIN | DC-IN | GND | GND | GND